# EAGLE design uTTA_V1_Power (EAGLE 6.3)
VERSION: V1.0

## Sheet 1 of 3
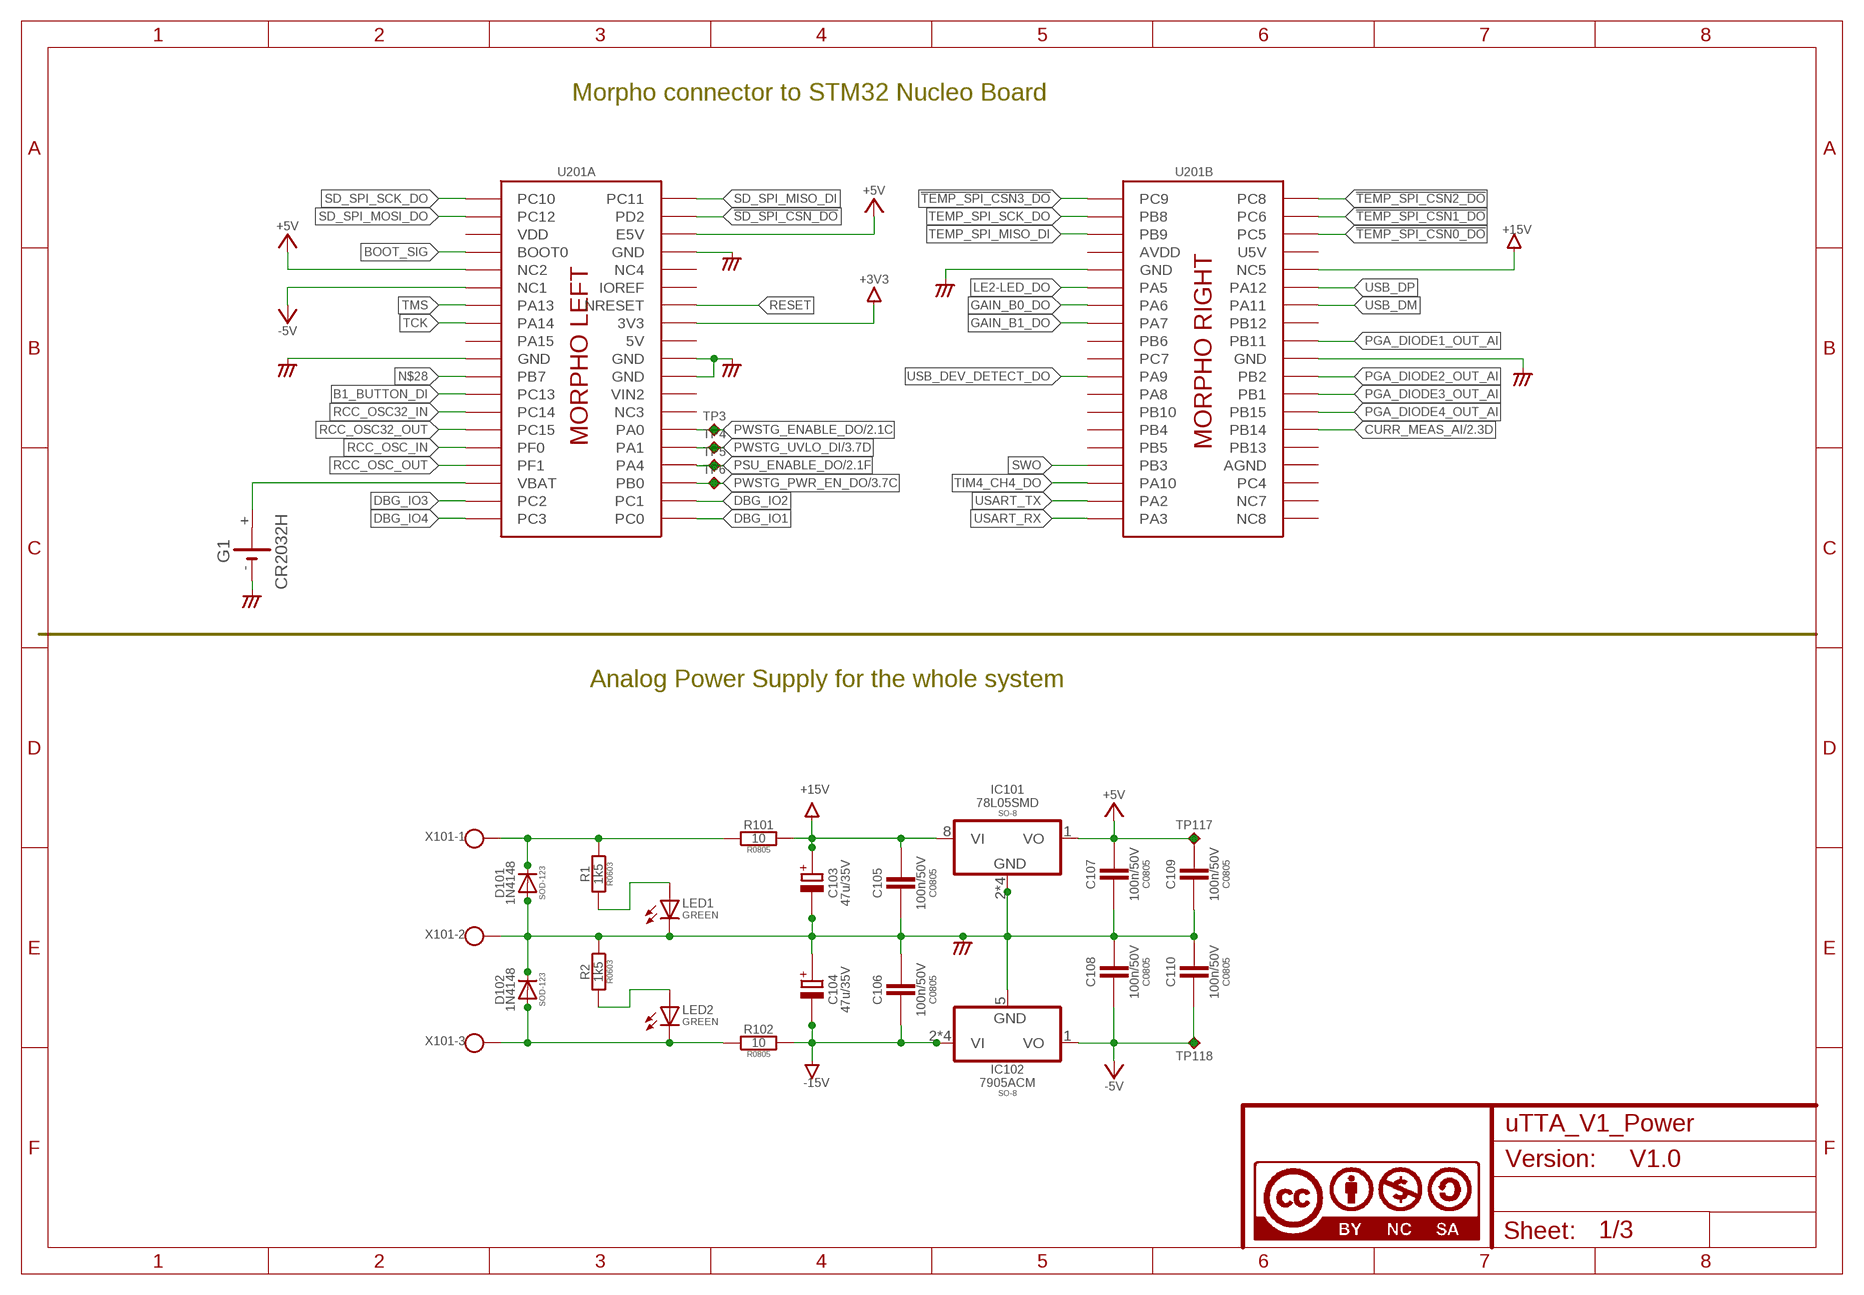
[diagram p0: schematic, sheet 1]

### Parts
C103  47u/35V  CPOL-EUD  [PANASONIC_D]
C104  47u/35V  CPOL-EUD  [PANASONIC_D]
C105  100n/50V  C-EUC0805  [C0805]
C106  100n/50V  C-EUC0805  [C0805]
C107  100n/50V  C-EUC0805  [C0805]
C108  100n/50V  C-EUC0805  [C0805]
C109  100n/50V  C-EUC0805  [C0805]
C110  100n/50V  C-EUC0805  [C0805]
D101  1N4148  DIODE-SOD123  [SOD123]
D102  1N4148  DIODE-SOD123  [SOD123]
G1  CR2032H  [CR2032H]
IC101  78L05SMD  78L08SMD  [SO08]
IC102  7905ACM  [SO08]
LED1  GREEN  LEDSML0805  [SML0805]
LED2  GREEN  LEDSML0805  [SML0805]
R1  1k5  R-EU_R0603  [R0603]
R2  1k5  R-EU_R0603  [R0603]
R101  10  R-EU_R0805  [R0805]
R102  10  R-EU_R0805  [R0805]
TP3  TPC90H30  [C90H30]
TP4  TPC90H30  [C90H30]
TP5  TPC90H30  [C90H30]
TP6  TPC90H30  [C90H30]
TP117  TPC90H30  [C90H30]
TP118  TPC90H30  [C90H30]
U201  NUCLEO_F103_BOT  [NUCLEO_BRD64_LOWER]
X101  AST_03_3,5MM  AST_03_3,5MM_45°  [AST_453_3,5]

### Nets
!SD_SPI_CSN_DO: U201.L_PD2(A:PD2)
!TEMP_SPI_CSN0_DO: U201.R_PC5(B:PC5)
!TEMP_SPI_CSN1_DO: U201.R_PC6(B:PC6)
!TEMP_SPI_CSN2_DO: U201.R_PC8(B:PC8)
!TEMP_SPI_CSN3_DO: U201.R_PC9(B:PC9)
+3V3: U201.L_3V3(A:3V3)
+5V: C107.1 C109.1 IC101.1(VO) TP117.P$1(TP) U201.L_E5V(A:E5V) U201.L_NC2(A:NC2) ; also sheet 2,3
+15V: C103.+ C105.1 IC101.8(VI) R101.2 U201.R_NC5(B:NC5)
-5V: C108.2 C110.2 IC102.1(VO) TP118.P$1(TP) U201.L_NC1(A:NC1) ; also sheet 2
-15V: C104.- C106.2 IC102.2(VI) IC102.3(VI) IC102.6(VI) IC102.7(VI) R102.2
AGND: C103.- C104.+ C105.2 C106.1 C107.2 C108.1 C109.2 C110.1 D101.A D102.C G1.- IC101.2(GND) IC101.3(GND) IC101.6(GND) IC101.7(GND) IC102.5(GND) LED1.C R2.1 U201.L_GND3(A:GND) U201.L_GND4(A:GND) U201.L_GND5(A:GND) U201.L_GND(A:GND) U201.R_GND7(B:GND) U201.R_GND8(B:GND) X101.2_1 X101.2_2 ; supply symbol labelled AGND_ ; also sheet 2,3
B1_BUTTON_DI: U201.L_PC13(A:PC13)
BOOT_SIG: U201.L_BOOT0(A:BOOT0)
CURR_MEAS_AI [Analog_Sig]: U201.R_PB14(B:PB14) ; also sheet 2
DBG_IO1: U201.L_PC0(A:PC0)
DBG_IO2: U201.L_PC1(A:PC1)
DBG_IO3: U201.L_PC2(A:PC2)
DBG_IO4: U201.L_PC3(A:PC3)
GAIN_B0_DO: U201.R_PA6(B:PA6)
GAIN_B1_DO: U201.R_PA7(B:PA7)
IN+: D101.C R1.1 R101.1 X101.1_1 X101.1_2
IN-: D102.A LED2.C R102.1 X101.3_1 X101.3_2
LE2-LED_DO: U201.R_PA5(B:PA5)
N$12: G1.+ U201.L_VBAT(A:VBAT)
N$28: U201.L_PB7(A:PB7)
N$54: LED1.A R1.2
N$58: LED2.A R2.2
PGA_DIODE1_OUT_AI: U201.R_PB11(B:PB11)
PGA_DIODE2_OUT_AI: U201.R_PB2(B:PB2)
PGA_DIODE3_OUT_AI: U201.R_PB1(B:PB1)
PGA_DIODE4_OUT_AI: U201.R_PB15(B:PB15)
PSU_ENABLE_DO: TP5.P$1(TP) U201.L_PA4(A:PA4) ; also sheet 2
PWSTG_ENABLE_DO: TP3.P$1(TP) U201.L_PA0(A:PA0) ; also sheet 2
PWSTG_PWR_EN_DO: TP6.P$1(TP) U201.L_PB0(A:PB0) ; also sheet 3
PWSTG_UVLO_DI: TP4.P$1(TP) U201.L_PA1(A:PA1) ; also sheet 3
RCC_OSC32_IN: U201.L_PC14(A:PC14)
RCC_OSC32_OUT: U201.L_PC15(A:PC15)
RCC_OSC_IN: U201.L_PF0(A:PF0)
RCC_OSC_OUT: U201.L_PF1(A:PF1)
RESET: U201.L_RESET(A:NRESET)
SD_SPI_MISO_DI: U201.L_PC11(A:PC11)
SD_SPI_MOSI_DO: U201.L_PC12(A:PC12)
SD_SPI_SCK_DO: U201.L_PC10(A:PC10)
SWO: U201.R_PB3(B:PB3)
TCK: U201.L_PA14(A:PA14)
TEMP_SPI_MISO_DI: U201.R_PB9(B:PB9)
TEMP_SPI_SCK_DO: U201.R_PB8(B:PB8)
TIM4_CH4_DO: U201.R_PA10(B:PA10)
TMS: U201.L_PA13(A:PA13)
USART_RX: U201.R_PA3(B:PA3)
USART_TX: U201.R_PA2(B:PA2)
USB_DEV_DETECT_DO: U201.R_PA9(B:PA9)
USB_DM: U201.R_PA11(B:PA11)
USB_DP: U201.R_PA12(B:PA12)
Unconnected: G1.+@1(+) U201.L_IOREF(A:IOREF) U201.L_NC3(A:NC3) U201.L_NC4(A:NC4) U201.L_PA15(A:PA15) U201.R_NC7(B:NC7) U201.R_NC8(B:NC8) U201.R_PA8(B:PA8) U201.R_PB4(B:PB4) U201.R_PB5(B:PB5) U201.R_PB6(B:PB6) U201.R_PB10(B:PB10) U201.R_PB12(B:PB12) U201.R_PB13(B:PB13) U201.R_PC4(B:PC4) U201.R_PC7(B:PC7)

### Notes on the sheet
- Morpho connector to STM32 Nucleo Board
- Analog Power Supply for the whole system

## Sheet 2 of 3
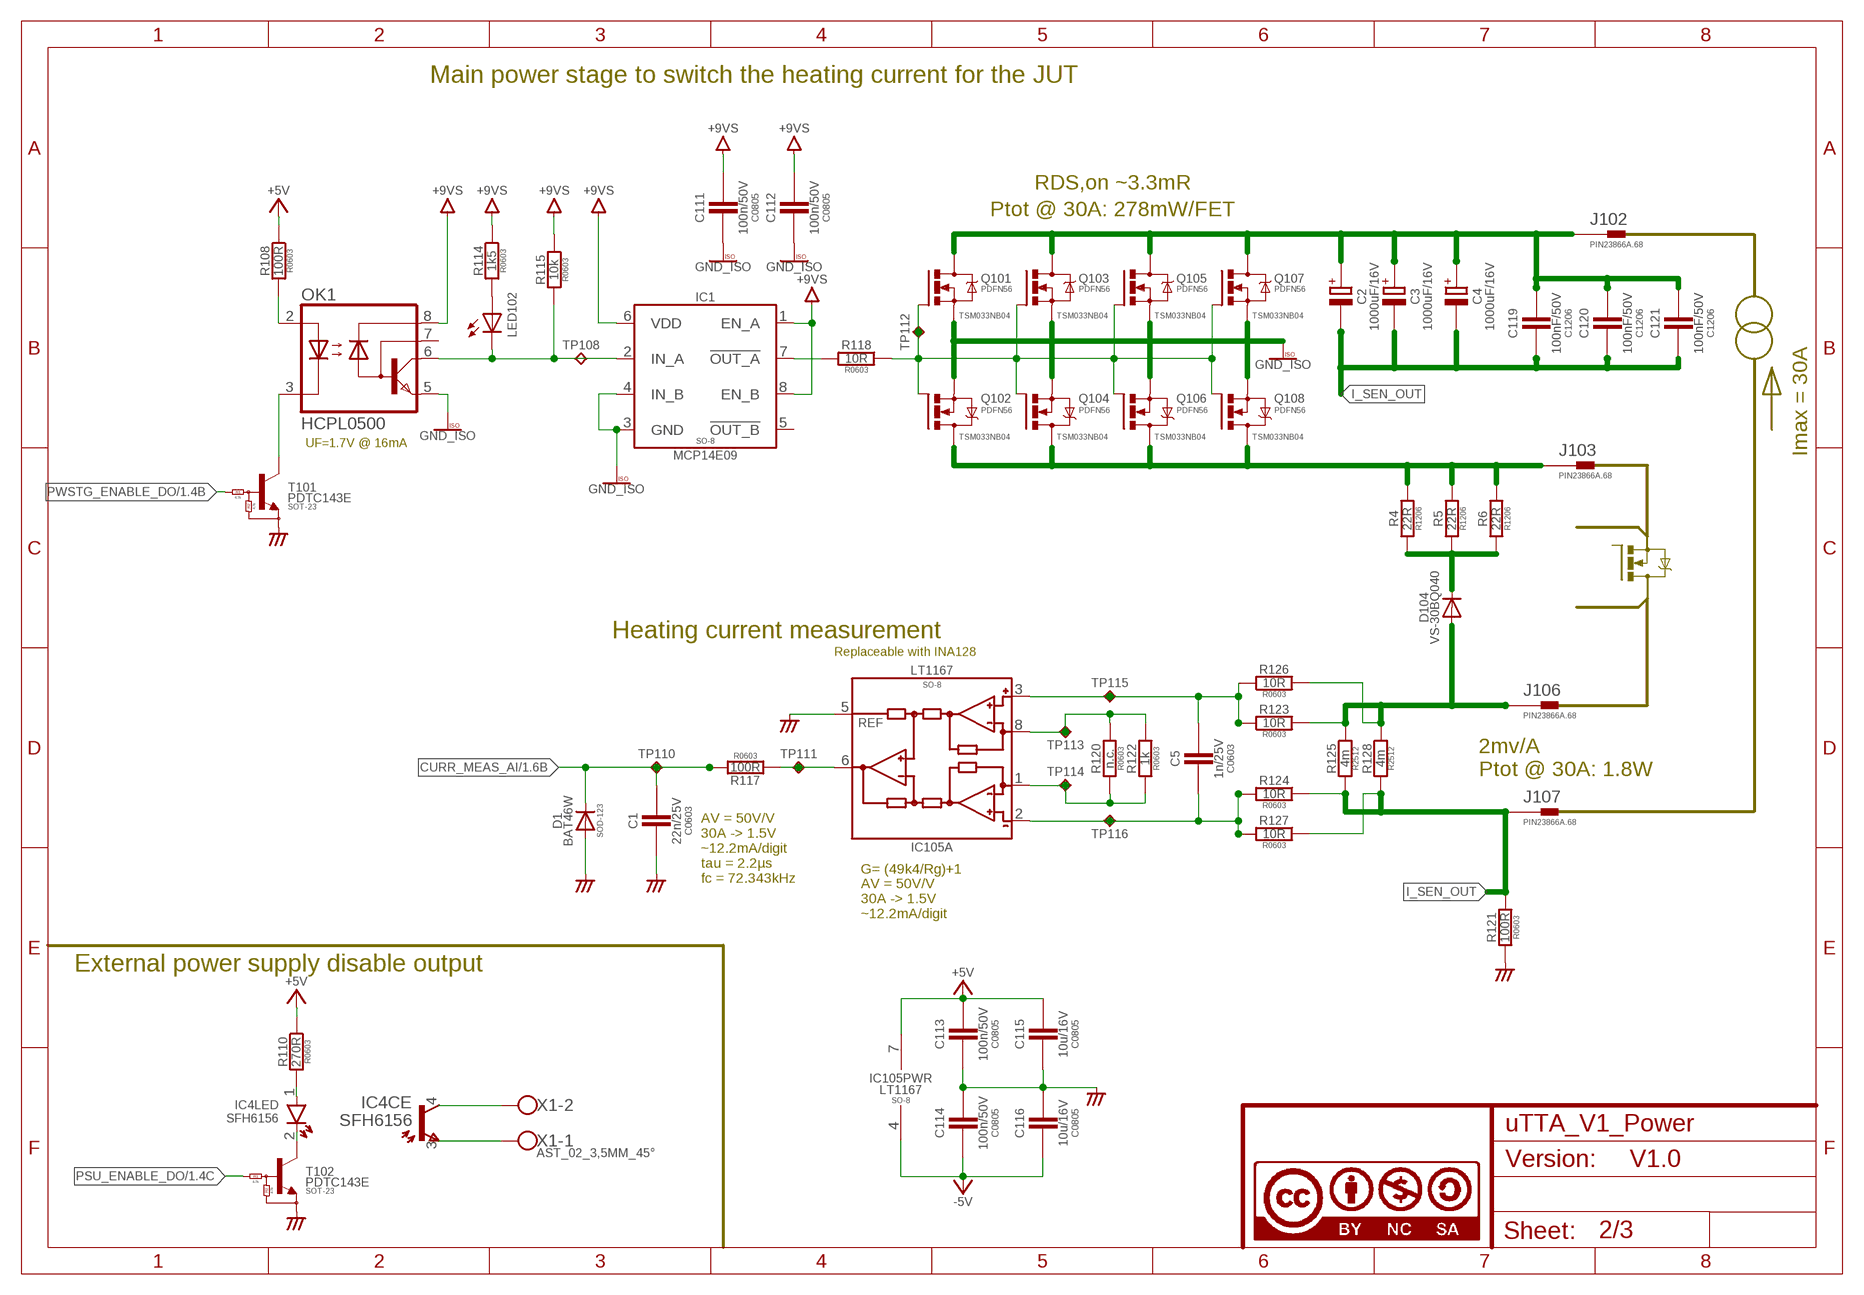
[diagram p1: schematic, sheet 2]

### Parts
C1  22n/25V  C-EUC0603  [C0603]
C2  1000uF/16V  CPOL-EUE5-10.5  [E5-10,5]
C3  1000uF/16V  CPOL-EUE5-10.5  [E5-10,5]
C4  1000uF/16V  CPOL-EUE5-10.5  [E5-10,5]
C5  1n/25V  C-EUC0603  [C0603]
C111  100n/50V  C-EUC0805  [C0805]
C112  100n/50V  C-EUC0805  [C0805]
C113  100n/50V  C-EUC0805  [C0805]
C114  100n/50V  C-EUC0805  [C0805]
C115  10u/16V  C-EUC0805  [C0805]
C116  10u/16V  C-EUC0805  [C0805]
C119  100nF/50V  C-EUC1206  [C1206]
C120  100nF/50V  C-EUC1206  [C1206]
C121  100nF/50V  C-EUC1206  [C1206]
D1  BAT46W  DIODE-SOD123  [SOD123]
D104  VS-30BQ040  DIODE-SMC  [SMC]
IC1  MCP14E09  [SO-08]
IC4  SFH6156  [SFH]
IC105  LT1167  [SO08]
J102  PIN23866A.68  [VOGT_3866A.68]
J103  PIN23866A.68  [VOGT_3866A.68]
J106  PIN23866A.68  [VOGT_3866A.68]
J107  PIN23866A.68  [VOGT_3866A.68]
LED102  LEDSML0805  [SML0805]
OK1  HCPL0500  [SOIC08]
Q101  TSM033NB04  TSM033NB04CR  [PDFN56]
Q102  TSM033NB04  TSM033NB04CR  [PDFN56]
Q103  TSM033NB04  TSM033NB04CR  [PDFN56]
Q104  TSM033NB04  TSM033NB04CR  [PDFN56]
Q105  TSM033NB04  TSM033NB04CR  [PDFN56]
Q106  TSM033NB04  TSM033NB04CR  [PDFN56]
Q107  TSM033NB04  TSM033NB04CR  [PDFN56]
Q108  TSM033NB04  TSM033NB04CR  [PDFN56]
R4  22R  R-EU_R1206  [R1206]
R5  22R  R-EU_R1206  [R1206]
R6  22R  R-EU_R1206  [R1206]
R108  100R  R-EU_R0603  [R0603]
R110  270R  R-EU_R0603  [R0603]
R114  1k5  R-EU_R0603  [R0603]
R115  10k  R-EU_R0603  [R0603]
R117  100R  R-EU_R0603  [R0603]
R118  10R  R-EU_R0603  [R0603]
R120  n.c.  R-EU_R0603  [R0603]
R121  100R  R-EU_R0603  [R0603]
R122  1k  R-EU_R0603  [R0603]
R123  10R  R-EU_R0603  [R0603]
R124  10R  R-EU_R0603  [R0603]
R125  4m  WSL2512  [R2512]
R126  10R  R-EU_R0603  [R0603]
R127  10R  R-EU_R0603  [R0603]
R128  4m  WSL2512  [R2512]
T101  PDTC143E  [SOT23]
T102  PDTC143E  [SOT23]
TP108  TPC90H30  [C90H30]
TP110  TPC90H30  [C90H30]
TP111  TPC90H30  [C90H30]
TP112  TPC90H30  [C90H30]
TP113  TP  [C90]
TP114  TP  [C90]
TP115  TPC90H30  [C90H30]
TP116  TPC90H30  [C90H30]
X1  AST_02_3,5MM_45°  [AST_452_3,5]

### Nets
9V_SWITCHED: C111.1 C112.1 IC1.1(EN_A) IC1.6(VDD) IC1.8(EN_B) OK1.8(VCC) R114.1 R115.1 ; supply symbol labelled +9VS ; also sheet 3
+5V: C113.1 C115.1 IC105.7(PWR:V+) R108.1 R110.1 ; also sheet 1,3
-5V: C114.2 C116.2 IC105.4(PWR:V-) ; also sheet 1
AGND: C1.2 C113.2 C114.1 C115.2 C116.1 D1.A IC105.5(A:REF) R121.1 T101.2(E) T102.2(E) ; supply symbol labelled AGND_ ; also sheet 1,3
CURR_AMP_GAIN_N [Analog_Sig]: IC105.1(A:RG) R120.1 R122.1 TP114.P$1(TP)
CURR_AMP_GAIN_P [Analog_Sig]: IC105.8(A:RG) R120.2 R122.2 TP113.P$1(TP)
CURR_AMP_OUT [Analog_Sig]: IC105.6(A:OUT) R117.2 TP111.P$1(TP)
CURR_MEAS_AI [Analog_Sig]: C1.1 D1.C R117.1 TP110.P$1(TP) ; also sheet 1
GND_ISO: C111.2 C112.2 IC1.3(GND) IC1.4(IN_B) OK1.5(GND) Q101.P$1(S) Q101.P$2(S) Q101.P$3(S) Q102.P$1(S) Q102.P$2(S) Q102.P$3(S) Q103.P$1(S) Q103.P$2(S) Q103.P$3(S) Q104.P$1(S) Q104.P$2(S) Q104.P$3(S) Q105.P$1(S) Q105.P$2(S) Q105.P$3(S) Q106.P$1(S) Q106.P$2(S) Q106.P$3(S) Q107.P$1(S) Q107.P$2(S) Q107.P$3(S) Q108.P$1(S) Q108.P$2(S) Q108.P$3(S) ; also sheet 3
I_SEN_IN: D104.A J106.A1 J106.A2 R123.2 R125.2(B) R126.2 R128.2(B)
I_SEN_OUT: C2.- C3.- C4.- C119.2 C120.2 C121.2 J107.A1 J107.A2 R121.2 R124.1 R125.1(A) R127.1 R128.1(A)
I_SENSE_N [Analog_Diff]: C5.2 IC105.2(A:-IN) R124.2 R127.2 TP116.P$1(TP)
I_SENSE_P [Analog_Diff]: C5.1 IC105.3(A:+IN) R123.1 R126.1 TP115.P$1(TP)
N$1: C2.+ C3.+ C4.+ C119.1 C120.1 C121.1 J102.A1 J102.A2 Q101.P$5(D) Q101.P$6(D) Q101.P$7(D) Q101.P$8(D) Q101.P$9(D) Q103.P$5(D) Q103.P$6(D) Q103.P$7(D) Q103.P$8(D) Q103.P$9(D) Q105.P$5(D) Q105.P$6(D) Q105.P$7(D) Q105.P$8(D) Q105.P$9(D) Q107.P$5(D) Q107.P$6(D) Q107.P$7(D) Q107.P$8(D) Q107.P$9(D)
N$2: IC1.7(!OUT_A) R118.2
N$3: Q101.P$4(G) Q102.P$4(G) Q103.P$4(G) Q104.P$4(G) Q105.P$4(G) Q106.P$4(G) Q107.P$4(G) Q108.P$4(G) R118.1 TP112.P$1(TP)
N$4: IC4.1(LED:A) R110.2
N$5: IC1.2(IN_A) LED102.C OK1.6(VO) R115.2 TP108.P$1(TP)
N$8: IC4.2(LED:K) T102.3(C)
N$16: LED102.A R114.2
N$18: OK1.3(C) T101.3(C)
N$23: D104.C R4.1 R5.1 R6.1
N$46: OK1.2(A) R108.2
N$47: J103.A1 J103.A2 Q102.P$5(D) Q102.P$6(D) Q102.P$7(D) Q102.P$8(D) Q102.P$9(D) Q104.P$5(D) Q104.P$6(D) Q104.P$7(D) Q104.P$8(D) Q104.P$9(D) Q106.P$5(D) Q106.P$6(D) Q106.P$7(D) Q106.P$8(D) Q106.P$9(D) Q108.P$5(D) Q108.P$6(D) Q108.P$7(D) Q108.P$8(D) Q108.P$9(D) R4.2 R5.2 R6.2
OK_PSU_C [Digital_Sig]: IC4.4(CE:C) X1.2_1 X1.2_2
OK_PSU_E [Digital_Sig]: IC4.3(CE:E) X1.1_1 X1.1_2
PSU_ENABLE_DO: T102.1(B) ; also sheet 1
PWSTG_ENABLE_DO: T101.1(B) ; also sheet 1
Unconnected: IC1.5(!OUT_B) OK1.7(VB)

### Notes on the sheet
- Main power stage to switch the heating current for the JUT
- RDS,on ~3.3mR
- Ptot @ 30A: 278mW/FET
- UF=1.7V @ 16mA
- Imax = 30A
- Heating current measurement
- Replaceable with INA128
- 2mv/A
  Ptot @ 30A: 1.8W
- G= (49k4/Rg)+1
- AV = 50V/V
  30A -> 1.5V
  ~12.2mA/digit
  tau = 2.2µs
  fc = 72.343kHz
- AV = 50V/V
  30A -> 1.5V
  ~12.2mA/digit
- External power supply disable output

## Sheet 3 of 3
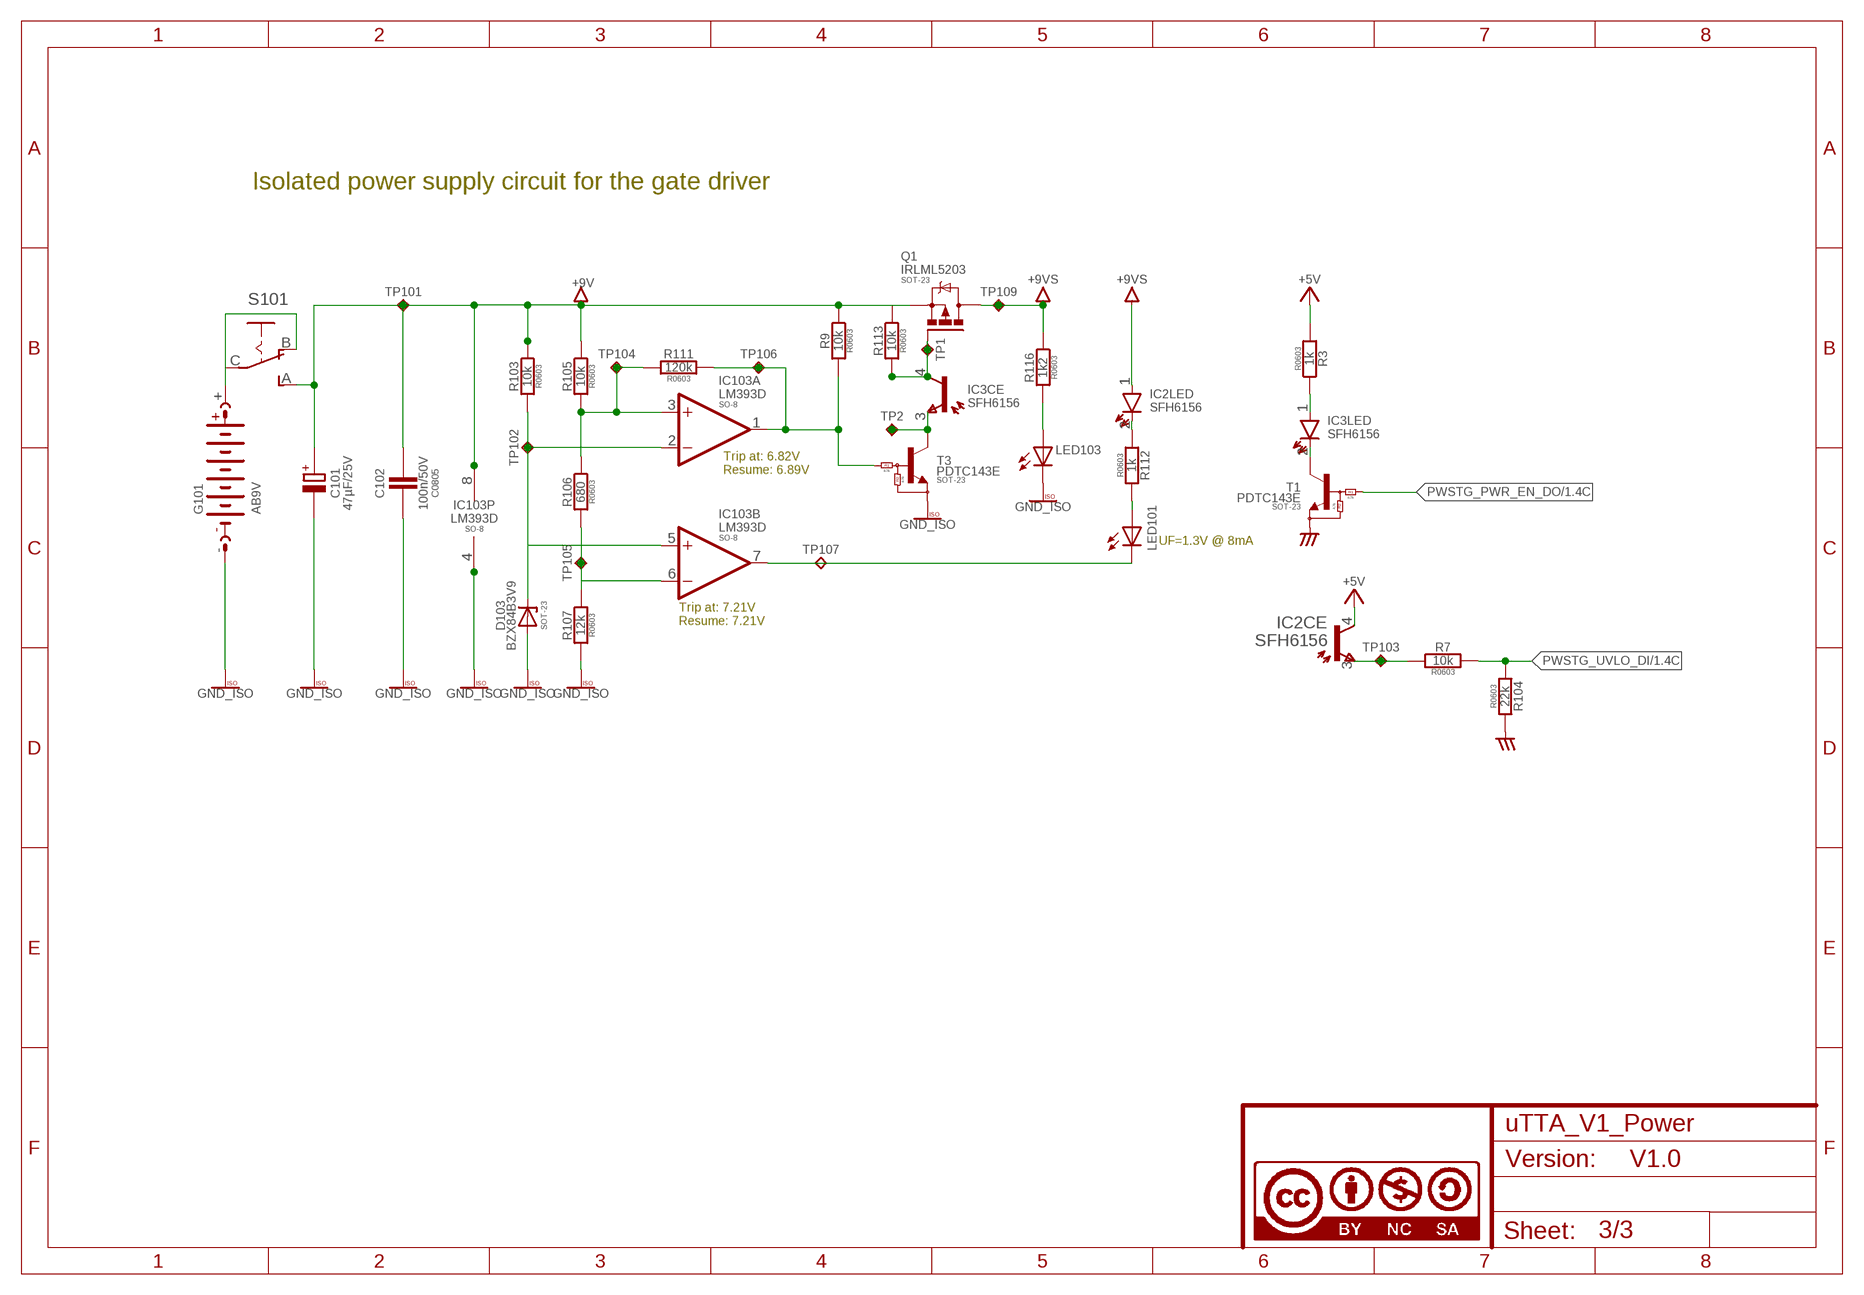
[diagram p2: schematic, sheet 3]

### Parts
C101  47µF/25V  CPOL-EUD  [PANASONIC_D]
C102  100n/50V  C-EUC0805  [C0805]
D103  BZX84B3V9  BZX84B  [SOT23]
G101  AB9V  [AB9V]
IC2  SFH6156  [SFH]
IC3  SFH6156  [SFH]
IC103  LM393D  [SO08]
LED101  LEDSML0805  [SML0805]
LED103  LEDSML0805  [SML0805]
Q1  IRLML5203  [MICRO3]
R3  1k  R-EU_R0603  [R0603]
R7  10k  R-EU_R0603  [R0603]
R9  10k  R-EU_R0603  [R0603]
R103  10k  R-EU_R0603  [R0603]
R104  22k  R-EU_R0603  [R0603]
R105  10k  R-EU_R0603  [R0603]
R106  680  R-EU_R0603  [R0603]
R107  12k  R-EU_R0603  [R0603]
R111  120k  R-EU_R0603  [R0603]
R112  1k  R-EU_R0603  [R0603]
R113  10k  R-EU_R0603  [R0603]
R116  1k2  R-EU_R0603  [R0603]
S101  SS_ESP101  [SS_ESP101]
T1  PDTC143E  [SOT23]
T3  PDTC143E  [SOT23]
TP1  TPC90H30  [C90H30]
TP2  TPC90H30  [C90H30]
TP101  TPC90H30  [C90H30]
TP102  TPC90H30  [C90H30]
TP103  TPC90H30  [C90H30]
TP104  TPC90H30  [C90H30]
TP105  TPC90H30  [C90H30]
TP106  TPC90H30  [C90H30]
TP107  TPC90H30  [C90H30]
TP109  TPC90H30  [C90H30]

### Nets
9V_SWITCHED: IC2.1(LED:A) Q1.3(D) R116.1 TP109.P$1(TP) ; supply symbol labelled +9VS ; also sheet 2
+5V: IC2.4(CE:C) R3.2 ; also sheet 1,2
+9V: C101.+ C102.1 IC103.8(P:V+) Q1.2(S) R9.1 R103.1 R105.1 R113.1 S101.A(S) TP101.P$1(TP)
AGND: R104.2 T1.2(E) ; supply symbol labelled AGND_ ; also sheet 1,2
GND_ISO: C101.- C102.2 D103.1(A) G101.- IC103.4(P:V-) LED103.C R107.2 T3.2(E) ; also sheet 2
N$7: IC103.7(B:OUT) LED101.C TP107.P$1(TP)
N$13: G101.+ S101.B(O) S101.C(P)
N$14: LED103.A R116.2
N$15: IC3.4(CE:C) Q1.1(G) R113.2 TP1.P$1(TP)
N$21: IC3.2(LED:K) T1.3(C)
N$22: IC3.1(LED:A) R3.1
N$24: IC2.3(CE:E) R7.1 TP103.P$1(TP)
N$26: IC3.3(CE:E) T3.3(C) TP2.P$1(TP)
N$32: D103.3(C) IC103.2(A:-IN) IC103.5(B:+IN) R103.2 TP102.P$1(TP)
N$33: IC103.6(B:-IN) R106.2 R107.1 TP105.P$1(TP)
N$41: IC103.3(A:+IN) R105.2 R106.1 R111.2 TP104.P$1(TP)
N$42: IC2.2(LED:K) R112.2
N$43: IC103.1(A:OUT) R9.2 R111.1 T3.1(B) TP106.P$1(TP)
N$53: LED101.A R112.1
PWSTG_PWR_EN_DO: T1.1(B) ; also sheet 1
PWSTG_UVLO_DI: R7.2 R104.1 ; also sheet 1

### Notes on the sheet
- Isolated power supply circuit for the gate driver
- Trip at: 6.82V
  Resume: 6.89V
- UF=1.3V @ 8mA
- Trip at: 7.21V
  Resume: 7.21V

## Power pins joined to a net without a drawn wire
5V: U201.L_5V(A:5V)
AGND: U201.R_AGND(B:AGND)
AVDD: U201.R_AVDD(B:AVDD)
U5V: U201.R_U5V(B:U5V)
VDD: U201.L_VDD(A:VDD)
VIN2: U201.L_VIN(A:VIN2)

## Library data of the parts
C1 C5 = A_Kondensatoren:C-EU: CAPACITOR, European symbol; PACKAGE: C0603
C2-C4 C101 C103 C104 = A_Kondensatoren:CPOL-EU: POLARIZED CAPACITOR, European symbol
C102 C105-C116 = A_Kondensatoren:C-EU: CAPACITOR, European symbol; PACKAGE: C0805
C119-C121 = A_Kondensatoren:C-EU: CAPACITOR, European symbol; PACKAGE: C1206
D1 D101 D102 = A_Dioden:DIODE-: DIODE; PACKAGE: SOD-123
D103 = A_Dioden:BZX84B; PACKAGE: SOT-23
D104 = A_Dioden:DIODE-: DIODE; PACKAGE: SMB
G1 = battery:CR2032H: LI BATTERY Varta
G101 = battery:AB9V: 9-V BATTERY CLIP
IC1 = A_Microchip:MCP14E09; PACKAGE: SO-8
IC2-IC4 = A_Optokoppler:SFH6156: 5.3 kV TRIOS High Reliability Optocoupler; MF: VISHAY/TELEFUNKEN; MPN: SFH6156-4T; OC_FARNELL: 1612479; OC_NEWARK: 21H7733
IC101 = A_Linear_IC:78L*SMD: Positive VOLTAGE REGULATOR; PACKAGE: SO-8
IC102 = A_Linear_IC:79*: Negative VOLTAGE REGULATOR; PACKAGE: SO-8
IC103 = A_Linear_IC:LM393: COMPARATOR; PACKAGE: SO-8
IC105 = A_Linear_Technology:LT1167; PACKAGE: SO-8
J102 J103 J106 J107 = A_Steckverbinder:PIN2: Flachstecker Typ Tyco/Electronics/AMP TAB, FASTON Printed Circuit Board Tabs Source: http://www.buerklin.com, http://catalog.tycoelectronics.com
LED1 LED2 LED101-LED103 = led:LED: LED OSRAM: - CHIPLED LG R971, LG N971, LY N971, LG Q971, LY Q971, LO R971, LY R971 LH N974, LH R974 LS Q976, LO Q976, LY Q976 LO Q996 - Hyper CHIPLED LW Q18S LB Q993, LB Q99A, LB R99A - SideLED LS A670, LO A670, LY A670, LG A670, LP A670 LB A673, LV A673, LT A673, LW A673 LH A674 LY A675 LS A676, LA A676, LO A676, LY A676, LW A676 LS A679, LY A679, LG A679 - Hyper Micro SIDELED® LS Y876, LA Y876, LO Y876, LY Y876 LT Y87S - SmartLED LW L88C, LW L88S LB L89C, LB L89S, LG L890 LS L89K, LO L89K, LY L89K LS L896, LA L896, LO L896, LY L896 - TOPLED LS T670, LO T670, LY T670, LG T670, LP T670 LSG T670, LSP T670, LSY T670, LOP T670, LYG T670 LG T671, LOG T671, LSG T671 LB T673, LV T673, LT T673, LW T673 LH T674 LS T676, LA T676, LO T676, LY T676, LB T676, LH T676, LSB T676, LW T676 LB T67C, LV T67C, LT T67C, LS T67K, LO T67K, LY T67K, LW E67C LS E67B, LA E67B, LO E67B, LY E67B, LB E67C, LV E67C, LT E67C LW T67C LS T679, LY T679, LG T679 LS T770, LO T770, LY T770, LG T770, LP T770 LB T773, LV T773, LT T773, LW T773 LH T774 LS E675, LA E675, LY E675, LS T675 LS T776, LA T776, LO T776, LY T776, LB T776 LHGB T686 LT T68C, LB T68C - Hyper Mini TOPLED® LB M676 - Mini TOPLED Santana® LG M470 LS M47K, LO M47K, LY M47K Source: http://www.osram.convergy.de LUXEON: - LUMILED® LXK2-PW12-R00, LXK2-PW12-S00, LXK2-PW14-U00, LXK2-PW14-V00 LXK2-PM12-R00, LXK2-PM12-S00, LXK2-PM14-U00 LXK2-PE12-Q00, LXK2-PE12-R00, LXK2-PE12-S00, LXK2-PE14-T00, LXK2-PE14-U00 LXK2-PB12-K00, LXK2-PB12-L00, LXK2-PB12-M00, LXK2-PB14-N00, LXK2-PB14-P00, LXK2-PB14-Q00 LXK2-PR12-L00, LXK2-PR12-M00, LXK2-PR14-Q00, LXK2-PR14-R00 LXK2-PD12-Q00, LXK2-PD12-R00, LXK2-PD12-S00 LXK2-PH12-R00, LXK2-PH12-S00 LXK2-PL12-P00, LXK2-PL12-Q00, LXK2-PL12-R00 Source: www.luxeon.com KINGBRIGHT: KA-3528ASYC Source: www.kingbright.com
OK1 = optocoupler:HCPL0500: HEWLETT PACKARD OPTO COUPLER
Q1 = A_Transistoren:IRLML5203: HEXFET P-Channel Power MOSFET; PACKAGE: SOT-23
Q101-Q108 = A_Transistoren:TSM033NB04CR: N-Ch MOSFET; PACKAGE: PDFN56
R1-R3 R7 R9 R103-R108 R110-R118 R120-R124 R126 R127 = A_Resistor:R-EU_: RESISTOR, European symbol; PACKAGE: R0603
R4-R6 = A_Resistor:R-EU_: RESISTOR, European symbol; PACKAGE: R1206
R101 R102 = A_Resistor:R-EU_: RESISTOR, European symbol; PACKAGE: R0805
R125 R128 = A_Shunts:WSL2512; PACKAGE: R2512
S101 = A_Schalter:SS_ESP101
T1 T3 T101 T102 = A_Transistoren:PDTC*: <N>NPN Resistor equipped transistors Part R1 R2 PDTA114E 10k 10k PDTA114T 10k open PDTA114Y 10k 47k PDTA115E 100k 100k PDTA115T 100k open PDTA123E 2.2k 2.2k PDTA123J 2.2k 47k PDTA123T 2.2k open PDTA123Y 2.2k 10k PDTA124E 4.7k 4.7k PDTA124T 22k open PDTA124X 22k 47k PDTA143E 4.7k 4.7k PDTA143T 4.7k open PDTA143X 4.7k 10k PDTA143Z 4.7k 47k PDTA144E 47k 47k PDTA144T 10k open PDTA144V 47k 10k PDTA144W 47k 22k; I_OUT: 100mA; PACKAGE: SOT-23; R1: 4.7k; R2: 4.7k
TP1-TP6 TP101-TP118 = A_Testpoint:TP
U201 = A_Stm32nucleo:NUCLEO_F103_BOT
X1 = A_Steckverbinder:AST_02
X101 = A_Steckverbinder:AST_03

## Net classes
0 default: width 0.254 mm, drill 0.3 mm, clearance 0.2 mm
1 Analog_Sig: width 0.305 mm, drill 0.3 mm, clearance 0.4 mm to class 0, clearance 0.3 mm
2 Digital_Sig: width 0.305 mm, drill 0.3 mm, clearance 0.25 mm to class 0, clearance 0.4 mm to class 1, clearance 0.3 mm
3 Analog_Diff: width 0.406 mm, drill 0.3 mm, clearance 0.5 mm to class 0, clearance 0.5 mm to class 1, clearance 0.5 mm to class 2, clearance 0.4 mm
9 GND: width 0.3 mm, drill 0.3 mm, clearance 0.2 mm to class 0, clearance 0.2 mm to class 1, clearance 0.2 mm to class 2, clearance 0.3 mm to class 3, clearance 0.2 mm to class 4, clearance 0.25 mm to class 5, clearance 0.25 mm to class 6, clearance 0.4 mm to class 7, clearance 0.4 mm to class 8, clearance 0.2 mm

## Board
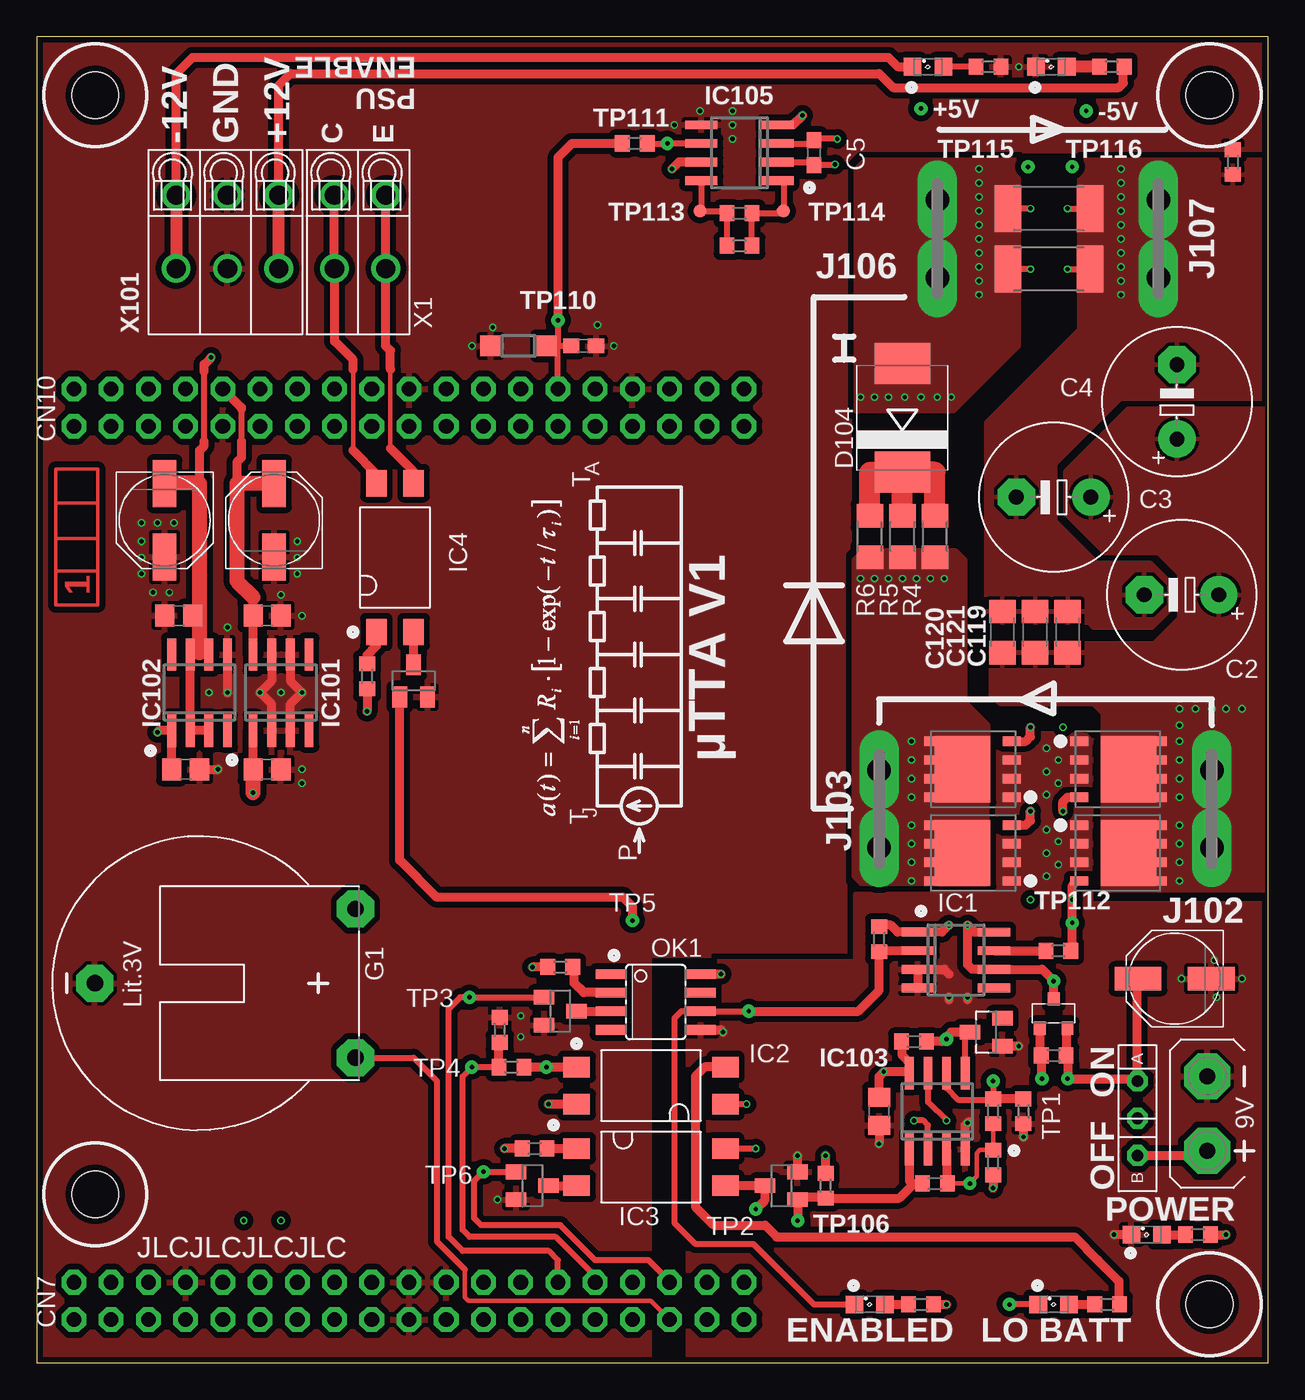
[diagram p3: board, top side]
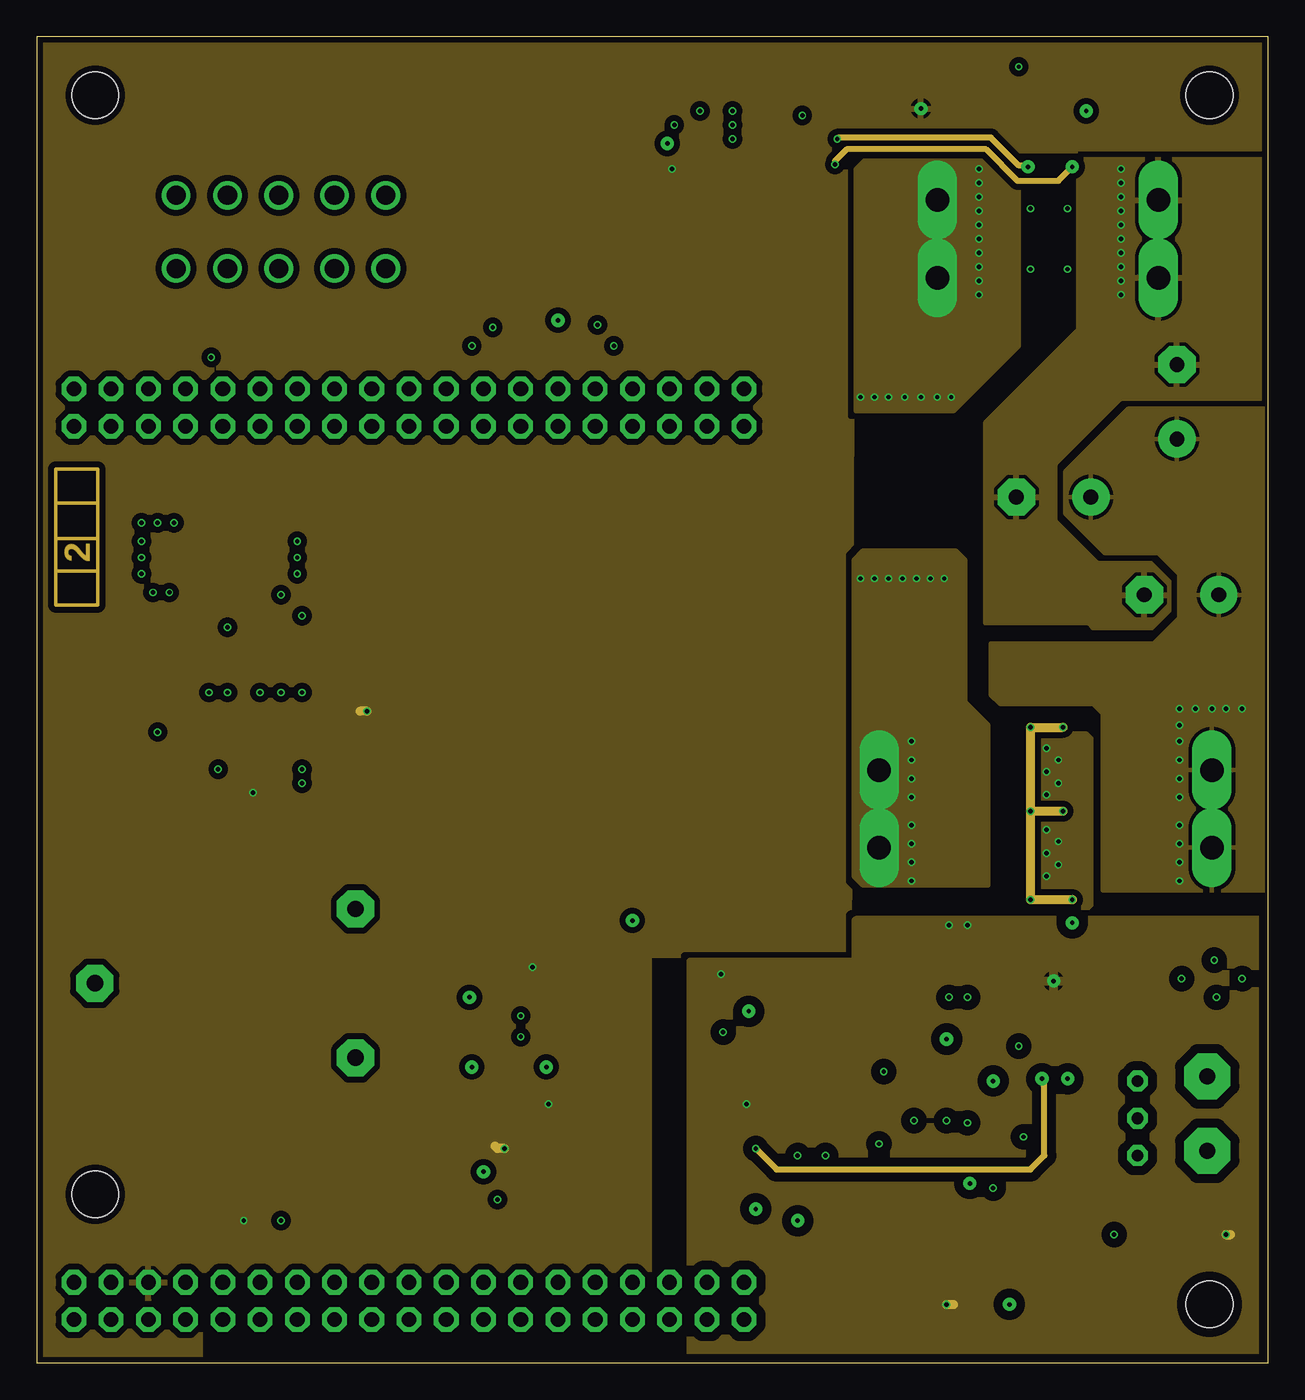
[diagram p4: board, inner layer Route2]
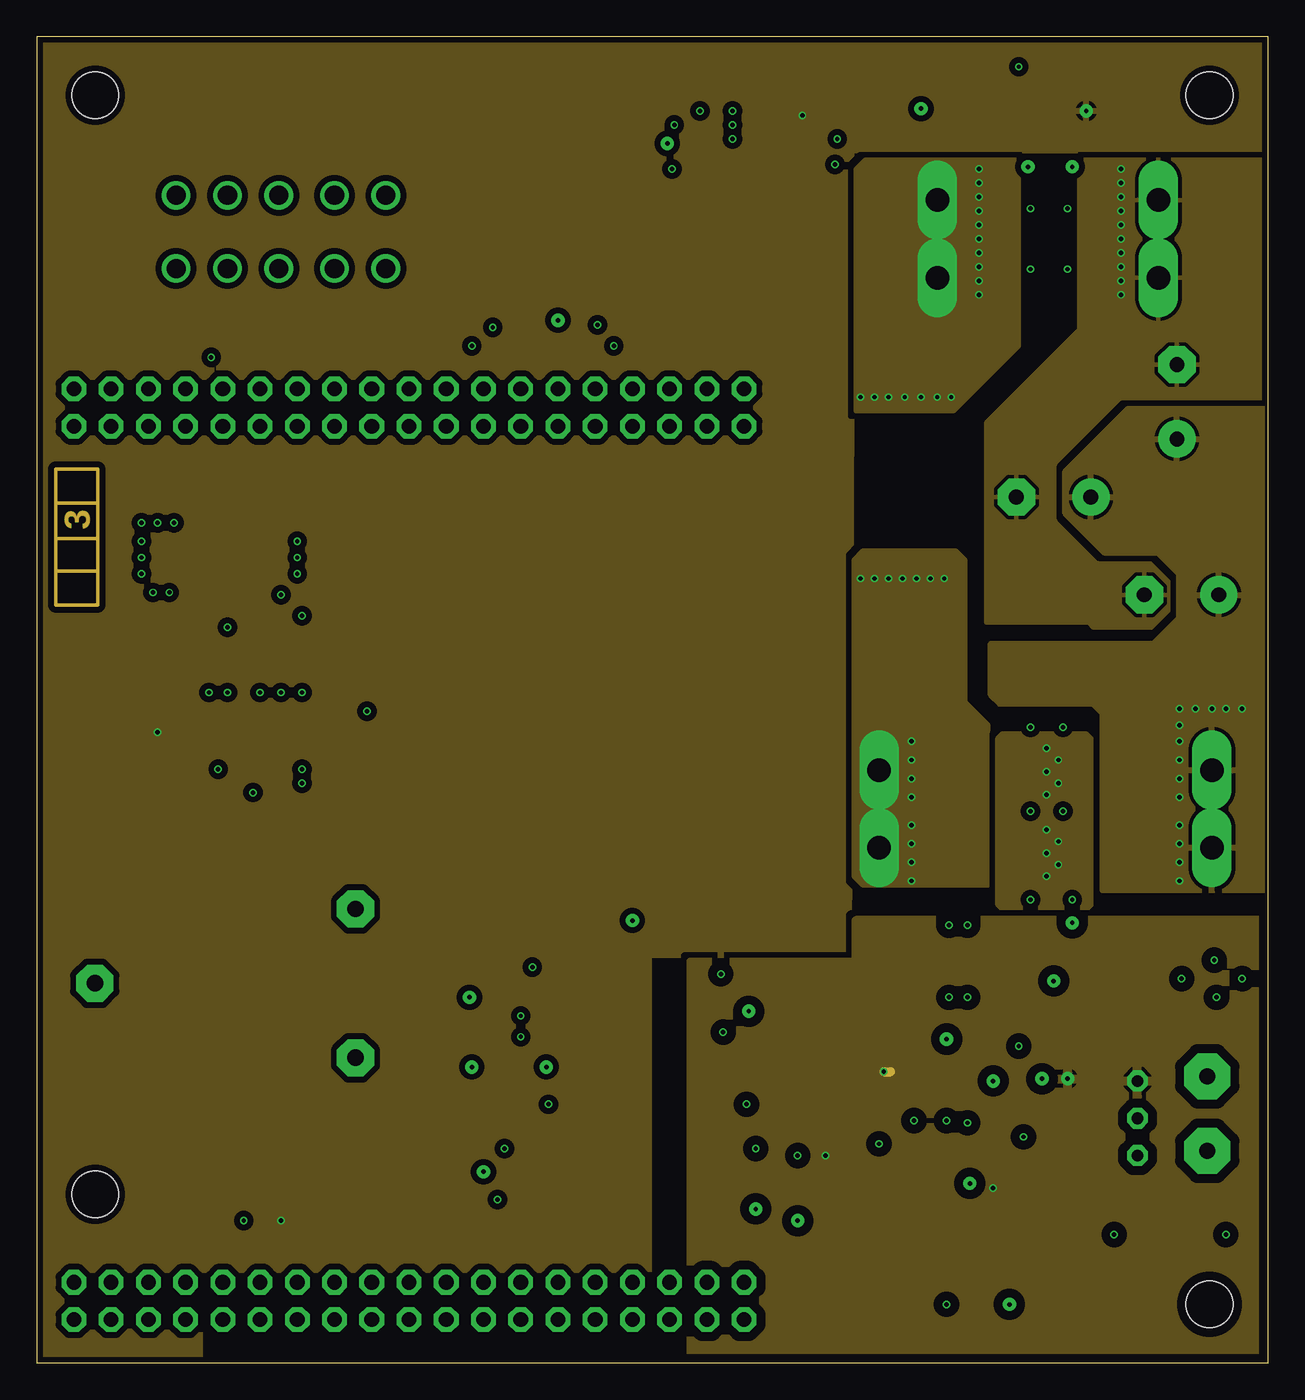
[diagram p5: board, inner layer Route15]
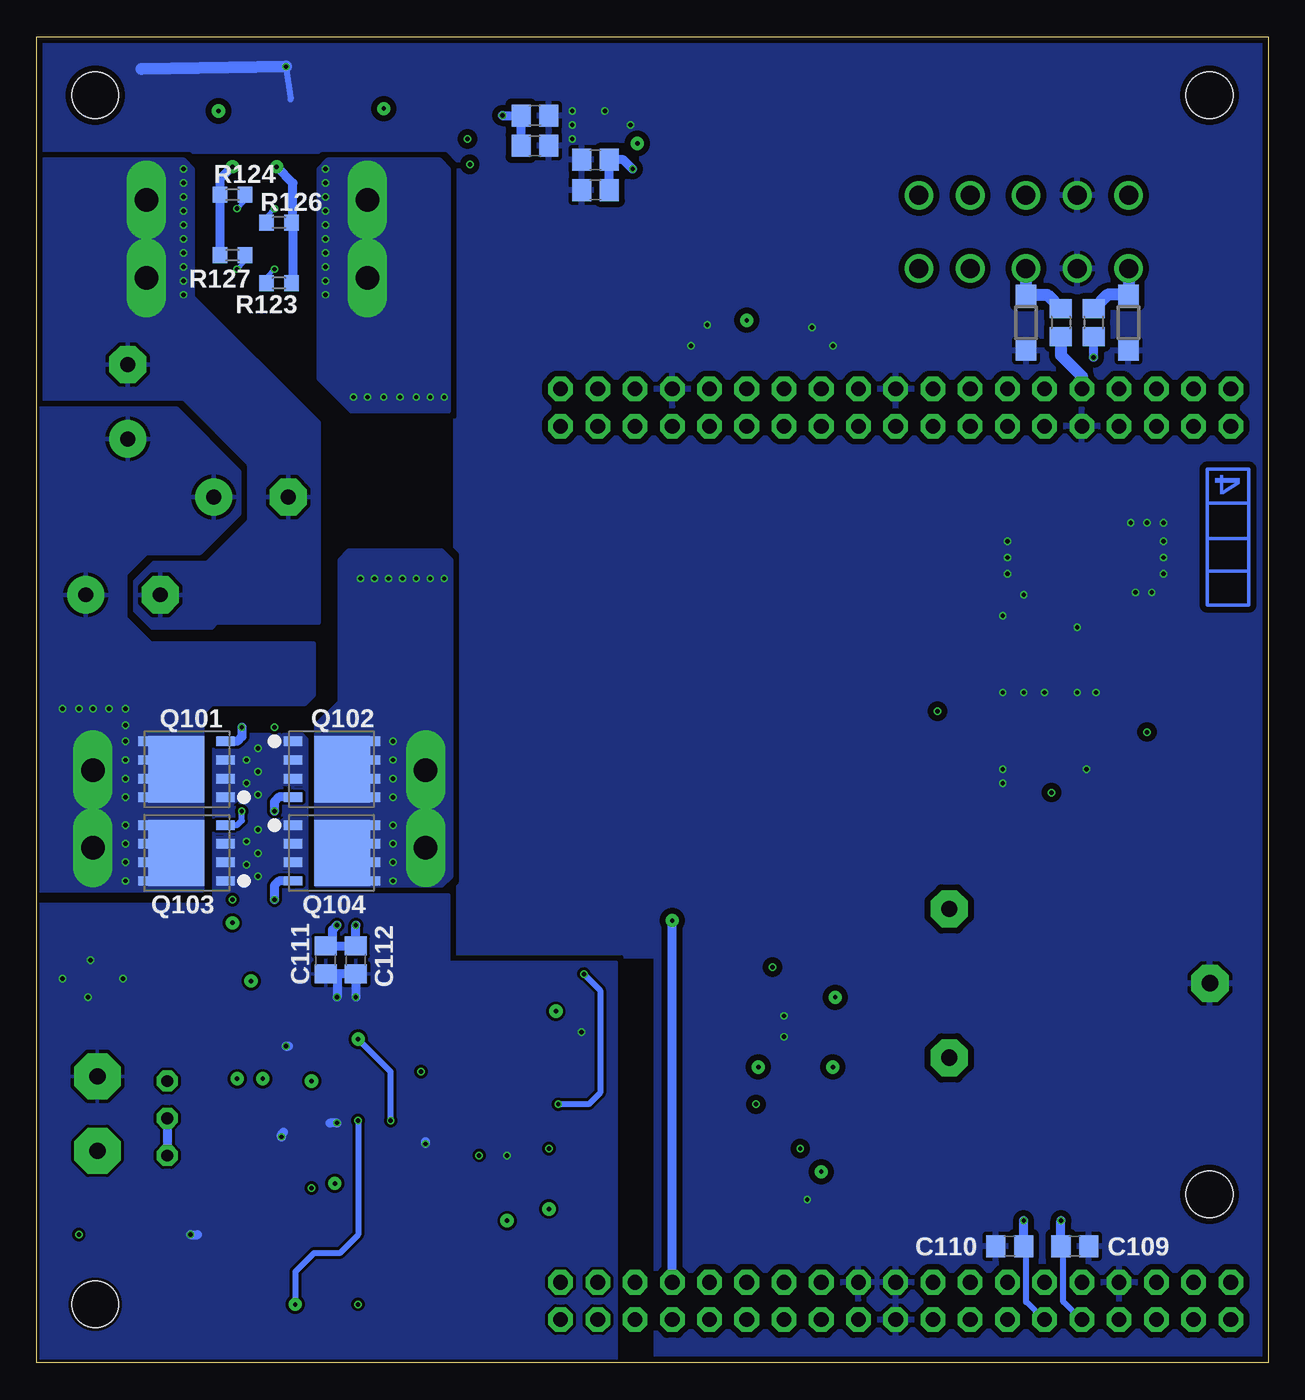
[diagram p6: board, bottom side, seen from below]

Size 84 x 90.5 mm. Coordinates in mm from the lower left corner, seen from the top.
Outline: 0,0 84,0 84,90.5 0,90.5 0,0
Copper layers (1*2*15*16): Top 0.035mm / dielectric 0.17mm / Route2 0.0175mm / dielectric 47mil / Route15 0.0175mm / dielectric 0.17mm / Bottom 0.035mm
Design rules "JLCPCB_4Layer": minimum track width 5mil, minimum drill 0.2mm, track to track 5mil, track to pad 0.2mm, pad to pad 5mil, via to via 5mil, smd to smd 0mil, copper to edge 0.2mm, drill to drill 0.5mm, minimum pad ring 4mil, minimum via ring 4mil, stop-mask expansion 3mil, vias tented up to drill 100mil, thermal gap 10mil
Holes 3.2 mm at 4,11.5 80,4 80,86.5 4,86.5

### Footprints (pad centres in the part's own frame; a part is rotated, then mirrored left to right if it is on the bottom)
C0603 = smd 1.1 x 1: 1 -0.85,0; 2 0.85,0
E5-10,5 = drill 1.016 pad 2.54: + -2.54,0 | drill 1.016 pad 2.54 octagon: - 2.54,0
PANASONIC_D = smd 3.2 x 1.6: + 2.5,0; - -2.5,0
C0805 = smd 1.3 x 1.5: 1 -0.95,0; 2 0.95,0
C1206 = smd 1.6 x 1.8: 1 -1.4,0; 2 1.4,0
SOD123 = smd 1.4 x 1.4: A 1.9,0; C -1.9,0
SOT23 = smd 1 x 1.4: 1 -0.95,-1.1; 2 0.95,-1.1; 3 0,1.1
SMC = smd 2.8 x 3.8: A 3.7,0; C -3.7,0
CR2032H = drill 1.118 pad 2.54 octagon: + 5.08,10.795; +@1 -5.08,10.795; - 0,-6.985
AB9V = drill 1.118 pad 3.15 octagon: + 0,2.54; - 0,-2.54
SO-08 = smd 0.6 x 2.2: 1 -1.905,-2.6; 2 -0.635,-2.6; 3 0.635,-2.6; 4 1.905,-2.6; 5 1.905,2.6; 6 0.635,2.6; 7 -0.635,2.6; 8 -1.905,2.6
SFH = smd 1.4 x 1.8: 1 1.27,5.08; 2 -1.27,5.08; 3 -1.27,-5.08; 4 1.27,-5.08
SO08 = smd 0.6 x 2.2: 1 -1.905,-2.6; 2 -0.635,-2.6; 3 0.635,-2.6; 4 1.905,-2.6; 5 1.905,2.6; 6 0.635,2.6; 7 -0.635,2.6; 8 -1.905,2.6
VOGT_3866A.68 = drill 1.6 pad 2.7 long: A1 -2.65,0; A2 2.65,0
SML0805 = smd 1.2 x 1.2: A 1.05,0; C -1.05,0
SOIC08 = smd 0.66 x 2.032: 1 -1.905,-3.073; 2 -0.635,-3.073; 3 0.635,-3.073; 4 1.905,-3.073; 5 1.905,3.073; 6 0.635,3.073; 7 -0.635,3.073; 8 -1.905,3.073
MICRO3 = smd 0.8 x 0.9: 1 -0.95,-1; 2 0.95,-1; 3 0,1
PDFN56 = smd 0.6 x 1.27: P$1 -1.905,-1.905; P$2 -0.635,-1.905; P$3 0.635,-1.905; P$4 1.905,-1.905 | smd 0.6 x 1.42: P$5 1.905,3.36; P$6 0.635,3.36; P$7 -0.635,3.36; P$8 -1.905,3.36 | smd 4.52 x 3.81: P$9 0,1.455
R0603 = smd 1 x 1.1: 1 -0.85,0; 2 0.85,0
R1206 = smd 1.6 x 1.803: 1 -1.422,0; 2 1.422,0
R0805 = smd 1.3 x 1.5: 1 -0.95,0; 2 0.95,0
R2512 = smd 1.8 x 3.2: 1 -2.8,0; 2 2.8,0
SS_ESP101 = drill 0.8 pad 1.422 octagon: A 2.54,0; B -2.54,0; C 0,0
C90H30 = drill 0.3 pad 0.9: P$1 0,0
C90 = smd 0.9 x 0.9: P$1 0,0
NUCLEO_BRD64_LOWER = drill 1 pad 1.676 octagon: L_3V3 5.79,33.02; L_5V 5.79,30.48; L_BOOT0 3.25,43.18; L_E5V 5.79,45.72; L_GND 5.79,43.18; L_GND3 3.25,27.94; L_GND4 5.79,25.4; L_GND5 5.79,27.94; L_IOREF 5.79,38.1; L_NC1 3.25,38.1; L_NC2 3.25,40.64; L_NC3 5.79,20.32; L_NC4 5.79,40.64; L_PA0 5.79,17.78; L_PA1 5.79,15.24; L_PA4 5.79,12.7; L_PA13 3.25,35.56; L_PA14 3.25,33.02; L_PA15 3.25,30.48; L_PB0 5.79,10.16; L_PB7 3.25,25.4; L_PC0 5.79,5.08; L_PC1 5.79,7.62; L_PC2 3.25,7.62; L_PC3 3.25,5.08; L_PC10 3.25,50.8; L_PC11 5.79,50.8; L_PC12 3.25,48.26; L_PC13 3.25,22.86; L_PC14 3.25,20.32; L_PC15 3.25,17.78; L_PD2 5.79,48.26; L_PF0 3.25,15.24; L_PF1 3.25,12.7; L_RESET 5.79,35.56; L_VBAT 3.25,10.16; L_VDD 3.25,45.72; L_VIN 5.79,22.86; R_AGND 66.75,12.7; R_AVDD 64.21,43.18; R_GND7 64.21,40.64; R_GND8 66.75,27.94; R_NC5 66.75,40.64; R_NC7 66.75,7.62; R_NC8 66.75,5.08; R_PA2 64.21,7.62; R_PA3 64.21,5.08; R_PA5 64.21,38.1; R_PA6 64.21,35.56; R_PA7 64.21,33.02; R_PA8 64.21,22.86; R_PA9 64.21,25.4; R_PA10 64.21,10.16; R_PA11 66.75,35.56; R_PA12 66.75,38.1; R_PB1 66.75,22.86; R_PB2 66.75,25.4; R_PB3 64.21,12.7; R_PB4 64.21,17.78; R_PB5 64.21,15.24; R_PB6 64.21,30.48; R_PB8 64.21,48.26; R_PB9 64.21,45.72; R_PB10 64.21,20.32; R_PB11 66.75,30.48; R_PB12 66.75,33.02; R_PB13 66.75,15.24; R_PB14 66.75,17.78; R_PB15 66.75,20.32; R_PC4 66.75,10.16; R_PC5 66.75,45.72; R_PC6 66.75,48.26; R_PC7 64.21,27.94; R_PC8 66.75,50.8; R_PC9 64.21,50.8; R_U5V 66.75,43.18
AST_452_3,5 = drill 1.3: 1_1 -1.75,2.5; 1_2 -1.75,-2.5; 2_1 1.75,2.5; 2_2 1.75,-2.5
AST_453_3,5 = drill 1.3: 1_1 -3.5,2.5; 1_2 -3.5,-2.5; 2_1 0,2.5; 2_2 0,-2.5; 3_1 3.5,2.5; 3_2 3.5,-2.5

### Placement (x,y rotation side)
C1  37.31,69.4 0 top
C2  78.11,52.41 180 top
C3  69.37,59.08 180 top
C4  77.79,65.59 90 top
C5  53.02,82.57 270 top
C101  77.63,26.22 180 top
C102  57.47,17.17 270 top
C103  16.19,57.49 90 top
C104  8.73,57.49 270 top
C105  15.72,50.98 0 top
C106  9.68,50.98 0 top
C107  15.72,40.51 0 top
C108  10.16,40.51 180 top
C109  13.18,7.96 0 bottom
C110  17.62,7.96 0 bottom
C111  64.29,27.49 270 bottom
C112  62.23,27.49 270 bottom
C113  45.88,82.1 180 bottom
C114  50.01,83.05 180 bottom
C115  45.88,80.03 180 bottom
C116  50.01,85.11 180 bottom
C119  70.33,49.87 90 top
C120  65.88,49.87 90 top
C121  68.1,49.87 90 top
D1  32.86,69.4 180 top
D101  16.51,70.98 270 bottom
D102  9.53,70.98 90 bottom
D103  64.77,22.57 90 top
D104  59.05,64.48 90 top
G1  10.95,25.9 270 top
G101  79.85,17.01 180 top
IC1  62.71,27.49 270 top
IC2  41.91,18.91 270 top
IC3  41.91,13.36 90 top
IC4  24.45,54.95 180 top
IC101  16.67,45.74 0 top
IC102  11.11,45.74 0 top
IC103  61.44,17.17 0 top
IC105  47.94,82.57 90 top
J102  80.17,37.81 270 top
J103  57.47,37.81 90 top
J106  61.44,76.7 270 top
J107  76.52,76.7 270 top
LED1  69.22,88.45 0 top
LED2  60.8,88.45 0 top
LED101  69.37,3.99 0 top
LED102  56.83,3.99 0 top
LED103  75.72,8.76 0 top
OK1  42.23,24.63 270 top
Q1  69.37,23.84 0 top
Q101  73.03,40.51 90 bottom
Q102  64.61,40.51 270 bottom
Q103  73.03,34.79 90 bottom
Q104  64.61,34.79 270 bottom
Q105  73.03,40.51 270 top
Q106  64.61,40.51 90 top
Q107  73.03,34.79 270 top
Q108  64.61,34.79 90 top
R1  73.34,88.45 180 top
R2  64.93,88.45 180 top
R3  33.97,14.63 180 top
R4  61.28,56.38 270 top
R5  59.05,56.38 270 top
R6  56.83,56.38 270 top
R7  32.38,20.18 180 top
R9  53.82,12.09 270 top
R101  14.13,70.98 270 bottom
R102  11.91,70.98 270 bottom
R103  59.85,21.93 0 top
R104  31.59,22.73 90 top
R105  65.25,13.68 90 top
R106  65.25,17.17 90 top
R107  67.31,17.17 270 top
R108  35.72,27.01 0 top
R110  22.54,46.85 90 top
R111  61.28,12.25 0 top
R112  73.03,3.99 0 top
R113  69.37,20.98 180 top
R114  60.33,3.99 180 top
R115  57.47,28.92 270 top
R116  79.22,8.76 180 top
R117  40.8,83.21 0 top
R118  69.69,28.12 180 top
R120  47.94,76.22 180 top
R121  81.6,81.94 270 top
R122  47.94,78.45 180 top
R123  67.47,73.68 180 bottom
R124  70.64,79.72 180 bottom
R125  69.06,78.76 180 top
R126  67.47,77.81 180 bottom
R127  70.64,75.59 180 bottom
R128  69.06,74.64 180 top
S101  75.09,16.69 90 top
T1  33.81,12.09 270 top
T3  50.8,12.09 90 top
T101  35.72,24 270 top
T102  25.72,46.54 0 top
TP1  68.58,19.39 270 top
TP2  49.05,10.5 0 top
TP3  29.53,24.95 0 top
TP4  29.69,20.18 0 top
TP5  40.64,30.19 0 top
TP6  30.48,13.04 0 top
TP101  70.33,19.39 180 top
TP102  62.07,22.09 180 top
TP103  34.77,20.18 0 top
TP104  63.66,12.25 180 top
TP105  65.25,19.23 180 top
TP106  51.91,9.71 0 top
TP107  66.36,3.99 0 top
TP108  48.58,24 90 top
TP109  69.37,26.06 270 top
TP110  35.56,71.14 180 top
TP111  43.02,83.21 270 top
TP112  70.64,30.03 0 top
TP113  45.24,78.61 270 top
TP114  50.96,78.61 270 top
TP115  67.63,81.62 0 top
TP116  70.64,81.62 0 top
TP117  60.33,85.59 0 top
TP118  71.6,85.43 0 top
U201  53.34,-0.29 90 top
U$7  [A4_LOC_CC_BY_NC_SA]  -69.85,-50.62 0 top  (outside the outline)
X1  22.07,77.18 180 top
X101  13.02,77.18 180 top

### Tracks (layer width: path | path; a pad name or v marks a point on that pad's centre or on a via)
9V_SWITCHED  (via drill 0.3)
  Top 0.406: v48.42,17.64 IC2.1
  Top 0.61: v62.23,29.87 61.75,29.39 IC1.1 58.74,29.39 58.26,29.87 57.57,29.87 R115.1 | IC1.8 63.98,29.39 v63.5,29.87 63.5,27.17 63.82,26.85 IC1.6 68.58,26.85 TP109.P$1 Q1.3 | R116.1 v81.12,8.76 | R114.1 v62.07,3.99 | OK1.8 v46.67,26.54
  Route2 0.61: v81.12,8.76 81.44,8.76 | v62.07,3.99 62.55,3.99
  Bottom 0.406: v46.67,26.54 45.56,25.42 45.56,18.44 46.35,17.64 v48.42,17.64
  Bottom 0.61: v62.23,29.87 C112.1 C111.1 63.82,28.44 63.82,29.55 v63.5,29.87
  pour Route2 (isolate 0.61): 44.61,27.33 44.61,-0.77 84.45,-0.77 84.45,30.19 55.88,30.19 55.88,27.33
+5V  (via drill 0.3)
  Top 0.61: C107.1 IC101.1 | IC2.4 v34.92,17.64 | R108.1 v33.81,27.01 | IC105.7 43.81,81.94 v43.34,81.46 | R3.2 v31.91,14.63 | R110.1 v22.54,44.47
  Top 1.016: v14.76,38.92 C107.1
  Route2 0.61: v31.91,14.63 31.43,14.63 31.27,14.79 | v22.54,44.47 22.07,44.47
  Bottom 0.406: U201.L_NC2 12.78,2.96 13.97,4.15 13.97,7.8 C109.1
  Bottom 0.61: v43.34,81.46 43.97,82.1 C113.1 C115.1 | C109.1 v14.13,9.71
  pour Route2 (isolate 0.406, rank 4): -0.48,-2.52 -0.48,91.5 85.57,91.5 85.57,82.73 55.56,82.73 55.56,65.59 55.4,27.8 41.75,27.8 41.75,-1.56 16.83,-1.56 16.83,4.31 11.11,4.31 11.11,-1.56 0.16,-1.56 0.16,-2.52
+9V  (via drill 0.3)
  Top 0.61: Q1.2 70.22,22.74 R113.1 70.33,20.88 TP101.P$1 75.09,19.39 | S101.A 75.09,19.39 | 75.09,19.39 75.09,26.18 C101.+ | R9.1 v53.82,14.15 | C102.1 57.47,19.55 v57.78,19.87 59.53,19.87 | IC103.8 59.53,19.87 | 59.53,19.87 59.53,20.5 59.05,20.98 59.05,21.88 R103.1 | R105.1 v65.25,11.93
  Route15 0.61: v57.78,19.87 58.26,19.87
  pour Route15 (isolate 0.61): 44.61,27.33 44.61,-0.77 84.45,-0.77 84.45,30.19 55.88,30.19 55.88,27.33
+15V
  Top 0.406: 13.97,65.11 13.97,62.89
  Top 0.61: C105.1 IC101.8 14.76,52.25 | U201.R_NC5 13.97,65.19 13.97,65.11 | 13.97,62.89 13.97,61.78 13.65,61.46 13.65,60.35 13.97,60.03
  Top 0.813: C103.+ 16.15,60.03 13.97,60.03 13.65,60.03 13.69,59.99
  Top 1.016: C103.+ 13.69,59.99 | 13.65,60.03 13.65,53.36 14.76,52.25
  Bottom 0.813: R101.2 14.13,68.76 12.7,67.33 U201.R_NC5
-5V  (via drill 0.3)
  Top 0.61: C108.2 IC102.1 8.35,43.14 v8.26,43.05 | IC105.4 51.59,84.48 v52.23,85.11
  Bottom 0.406: U201.L_NC1 15.31,2.96 16.51,4.15 16.51,7.8 C110.2
  Bottom 0.61: v52.23,85.11 C116.2 C114.2 | C110.2 v16.67,9.71
  pour Route15 (isolate 0.406, rank 4): -0.32,91.5 85.57,91.5 85.57,82.73 55.56,82.73 55.56,65.59 55.4,27.8 41.75,27.8 41.75,-1.56 41.43,-1.56 16.83,-1.56 16.83,-0.77 16.83,4.31 11.11,4.31 11.11,-1.56 0.16,-1.56 0.16,-2.52 -0.48,-2.52
-15V  (via drill 0.3)
  Top 0.305: C106.2 10.79,51.14 11.11,51.14
  Top 0.406: 11.43,62.89 11.43,67.65
  Top 0.61: IC102.3 IC102.2 IC102.7 | IC102.6 IC102.7 | IC102.7 11.01,48.34 11.11,48.44 | 11.11,60.03 11.11,62.25 11.43,62.57 11.43,62.89 | 11.43,67.65 11.43,68.13 v11.91,68.6
  Top 0.813: 8.77,60.03 C104.-
  Top 1.016: 8.77,60.03 11.11,60.03 11.11,51.14 11.11,48.44
  Bottom 0.61: v11.91,68.6 R102.2
AGND  (via drill 0.3)
  Top 0.61: IC102.5 v13.02,45.74 | IC101.7 16.03,46.54 v15.24,45.74 16.03,44.95 IC101.2 | IC101.3 17.3,44.95 v18.1,45.74 17.3,46.54 IC101.6 | C108.1 v12.38,40.51
  Bottom 0.406: v66.99,88.45 66.67,86.22
  Bottom 0.813: v66.99,88.45 76.83,88.29
  other vias: 13.02,50.19 11.75,45.74 7.14,56.06 7.14,54.95 7.14,53.84 7.94,52.57 9.05,52.57 17.78,53.84 17.78,56.06 17.78,54.95 18.1,39.55 18.1,40.51 16.67,45.74 7.14,57.33 8.26,57.33 9.37,57.33 33.02,23.68 33.02,22.25 31.43,11.14 18.1,50.98 16.67,52.41 38.26,70.83 39.37,69.4 29.69,69.4 31.11,70.67 43.5,84.48 45.24,85.43 47.47,85.43 47.47,83.53 47.47,84.48
  pour Bottom (isolate 0.406, rank 4): -0.48,-2.52 -0.48,91.5 85.57,91.5 85.57,82.73 57.63,82.73 55.4,80.51 55.4,27.8 41.75,27.8 41.75,-1.56 0.16,-1.56 0.16,-2.52
  pour Top (isolate 0.406, rank 4): -0.48,-2.52 -0.48,91.5 85.57,91.5 85.57,82.73 57.63,82.73 55.4,80.51 55.4,27.8 41.75,27.8 41.75,-1.56 0.16,-1.56 0.16,-2.52
CURR_AMP_GAIN_N
  Top 0.406: 50.48,78.45 R122.1 R120.1 | 50.48,78.45 50.8,78.45 TP114.P$1 | IC105.1 50.96,80.67 50.96,78.92 50.48,78.45
CURR_AMP_GAIN_P
  Top 0.406: IC105.8 45.34,78.7 TP113.P$1 46.83,78.61 R122.2 R120.2
CURR_AMP_OUT
  Top 0.406: R117.2 TP111.P$1 IC105.6
CURR_MEAS_AI
  Top 0.406: U201.R_PB14 35.56,69.4 | 35.56,69.4 D1.C | TP110.P$1 35.56,69.4 | C1.1 35.56,69.4
  Top 0.61: R117.1 36.51,83.21 35.56,82.26 TP110.P$1
GND_ISO  (via drill 0.3)
  Top 0.61: v62.23,24.95 62.23,24.79 | v63.5,24.95 63.5,24.79 | T3.2 v51.91,14.15 | OK1.5 46.67,22.73 v46.83,22.57 | LED103.C v73.5,8.76 | C102.2 v57.47,14.95 | D103.1 v66.99,21.62 v66.99,21.61 | IC103.4 63.34,16.22 v63.5,16.38 63.6,16.48 | R107.2 v67.31,15.42 | IC1.4 IC1.3 61.91,26.85 C112.2
  Bottom 0.61: v62.23,24.95 C112.2 C111.2 63.5,26.54 v63.5,24.95 | v73.5,8.76 73.03,8.76 | v57.47,14.95 57.47,15.11 | v66.99,21.61 66.83,21.61 | v63.5,16.38 63.98,16.38 | v67.31,15.42 67.31,15.58 67.15,15.74
  other vias: 69.69,41.14 68.9,40.35 69.69,39.55 68.9,38.76 68.9,41.93 69.69,35.58 68.9,34.79 69.69,34 68.9,33.2 68.9,36.38 82.23,26.22 80.33,27.49 80.49,24.95 78.11,26.22
  pour Bottom: 65.56,42.57 65.56,31.93 55.88,31.93 55.88,27.33 44.45,27.33 44.45,-0.29 84.3,-0.29 84.3,31.3 71.91,31.3 71.91,42.57 71.6,42.89 65.88,42.89
  pour Top (isolate 0.406): 65.56,42.57 65.56,31.93 55.88,31.93 55.88,27.33 44.45,27.33 44.45,-0.29 84.3,-0.29 84.3,31.3 71.91,31.3 71.91,42.57 71.6,42.89 65.88,42.89
  pour Route15 (isolate 0.406, rank 2): 65.56,42.57 65.56,31.3 66.2,30.66 71.28,30.66 71.91,31.3 71.91,42.57 71.6,42.89 65.88,42.89
  pour Route2 (isolate 0.406, rank 2): 65.56,42.57 65.56,31.3 66.2,30.66 71.28,30.66 71.91,31.3 71.91,42.57 71.6,42.89 65.88,42.89
  pour Top (isolate 0.406, no thermals): 65.56,42.57 65.56,31.3 66.2,30.66 71.28,30.66 71.91,31.3 71.91,42.57 71.6,42.89 65.88,42.89
  pour Bottom (isolate 0.406, no thermals): 65.56,42.57 65.56,31.3 66.2,30.66 71.28,30.66 71.91,31.3 71.91,42.57 71.6,42.89 65.88,42.89
I_SEN_IN  (via drill 0.3)
  Top 0.406: v67.79,74.64 R128.2 66.2,74.58 | v67.79,78.76 R125.2
  Bottom 0.305: R126.2 68.32,78.23 v67.79,78.76 | R123.2 68.32,74.1 v67.79,74.64
  other vias: 64.29,81.46 64.29,80.51 64.29,79.56 64.29,78.61 64.29,77.65 64.29,76.7 58.1,65.91 59.21,65.91 60.33,65.91 61.44,65.91 57.15,65.91 56.2,65.91 62.39,65.91 64.29,75.75 64.29,74.8 64.29,73.84 64.29,72.89
  pour Bottom (isolate 0.406, rank 3, no thermals): 62.55,64.95 55.88,64.95 55.88,81.46 56.52,82.1 64.14,82.1 64.77,81.46 64.77,67.17
  pour Top (isolate 0.406, rank 3, no thermals): 62.55,64.95 55.88,64.95 55.88,81.46 56.52,82.1 66.99,82.1 66.99,69.4
  pour Route2 (isolate 0.406, rank 3, no thermals): 62.55,64.95 55.88,64.95 55.88,81.46 56.52,82.1 66.99,82.1 66.99,69.4
  pour Route15 (isolate 0.406, rank 3, no thermals): 62.55,64.95 55.88,64.95 55.88,81.46 56.52,82.1 66.99,82.1 66.99,69.4
I_SEN_OUT  (via drill 0.3)
  Top 0.406: v70.33,78.76 R125.1 | v70.33,74.64 R128.1
  Bottom 0.305: R124.1 69.79,79.3 v70.33,78.76 | R127.1 69.79,75.17 v70.33,74.64
  other vias: 73.98,81.46 73.98,80.51 73.98,79.56 73.98,78.61 73.98,77.65 73.98,73.84 73.98,74.8 73.98,76.7 73.98,75.75 73.98,72.89
  pour Bottom (isolate 0.406, rank 2): 84.84,65.75 74.14,65.75 69.53,61.14 69.53,57.65 72.55,54.63 76.2,54.63 77.31,53.52 77.31,51.3 76.2,50.19 72.07,50.19 71.75,50.51 64.77,50.51 64.77,64.16 73.34,72.73 73.34,81.46 73.98,82.1 84.84,82.1
  pour Top (isolate 0.406, rank 2): 84.84,65.75 74.14,65.75 69.53,61.14 69.53,57.65 72.55,54.63 76.2,54.63 77.31,53.52 77.31,51.3 76.2,50.19 72.07,50.19 71.75,50.51 64.77,50.51 64.77,64.16 71.12,70.51 71.12,82.1 84.84,82.1
  pour Bottom (isolate 0.406, no thermals): 79.22,70.83 79.22,82.1 74.14,82.1 74.14,70.83
  pour Top (isolate 0.406, no thermals): 79.22,70.83 79.22,82.1 71.12,82.1 71.12,70.83
  pour Route2 (isolate 0.406, rank 2): 84.84,65.75 74.14,65.75 69.53,61.14 69.53,57.65 72.55,54.63 76.2,54.63 77.31,53.52 77.31,51.3 76.2,50.19 72.07,50.19 71.75,50.51 64.77,50.51 64.77,64.16 71.12,70.51 71.12,82.1 84.84,82.1
  pour Route15 (isolate 0.406, rank 2): 84.84,65.75 74.14,65.75 69.53,61.14 69.53,57.65 72.55,54.63 76.2,54.63 77.31,53.52 77.31,51.3 76.2,50.19 72.07,50.19 71.75,50.51 64.77,50.51 64.77,64.16 71.12,70.51 71.12,82.1 84.84,82.1
I_SENSE_N  (via drill 0.3)
  Top 0.406: IC105.2 52.81,81.94 C5.2 54.4,81.72 v54.45,81.78
  Route2 0.406: 70.57,81.62 TP116.P$1 69.69,80.67 66.9,80.67 64.76,82.81 55.24,82.81 54.45,82.01 v54.45,81.78
  Bottom 0.406: 71.44,75.59 R127.2
  Bottom 0.61: R127.2 R124.2 71.49,80.77 TP116.P$1
I_SENSE_P  (via drill 0.3)
  Top 0.406: IC105.3 52.81,83.21 C5.1 53.12,83.53 v54.61,83.53
  Route2 0.406: TP115.P$1 67.54,81.62 67.54,81.71 67,81.71 65.1,83.61 54.7,83.61 v54.61,83.53
  Bottom 0.406: R126.1 66.52,77.81
  Bottom 0.61: R123.1 66.52,73.68 66.52,77.81 66.52,80.51 TP115.P$1
IN+
  Top 0.61: X101.1_2 16.52,87.19 17.3,87.97 57.47,87.97 58.42,87.02 73.82,87.02 74.14,87.34 74.14,88.39 R1.1
  Top 0.813: X101.1_1 X101.1_2
  Bottom 0.813: R101.1 15.08,72.89 D101.C 16.51,74.67 X101.1_1
IN-
  Top 0.61: X101.3_2 9.52,87.96 10.64,89.08 58.1,89.08 58.74,88.45 LED2.C
  Top 0.813: X101.3_2 X101.3_1
  Bottom 0.813: X101.3_1 9.52,72.89 D102.A 10.96,72.89 R102.1
N$1  (via drill 0.3)
  other vias: 77.95,32.88 77.95,34.16 77.95,35.42 77.95,36.7 77.95,38.6 77.95,39.87 77.95,41.14 77.95,42.41 77.95,43.52 77.95,44.63 79.06,44.63 80.17,44.63 81.12,44.63 82.23,44.63
  pour Bottom: 72.71,32.25 72.71,44.31 72.07,44.95 65.72,44.95 65.09,45.59 65.09,49.08 76.2,49.08 77.95,50.82 77.95,53.84 76.52,55.27 72.87,55.27 70.17,57.97 70.17,60.83 74.45,65.11 85.84,65.11 85.84,32.25
  pour Top: 72.71,32.25 72.71,44.31 72.07,44.95 65.72,44.95 65.09,45.59 65.09,49.08 76.2,49.08 77.95,50.82 77.95,53.84 76.52,55.27 72.87,55.27 70.17,57.97 70.17,60.83 74.45,65.11 85.84,65.11 85.84,32.25
  pour Top (no thermals): 72.71,32.25 72.71,44.31 85.21,44.31 85.84,43.68 85.84,32.25
  pour Route2: 72.71,32.25 72.71,44.31 72.07,44.95 65.72,44.95 65.09,45.59 65.09,49.08 76.2,49.08 77.95,50.82 77.95,53.84 76.52,55.27 72.87,55.27 70.17,57.97 70.17,60.83 74.45,65.11 85.84,65.11 85.84,32.25
  pour Route15: 72.71,32.25 72.71,44.31 72.07,44.95 65.72,44.95 65.09,45.59 65.09,49.08 76.2,49.08 77.95,50.82 77.95,53.84 76.52,55.27 72.87,55.27 70.17,57.97 70.17,60.83 74.45,65.11 85.84,65.11 85.84,32.25
  pour Bottom (no thermals): 72.71,32.25 72.71,44.31 85.21,44.31 85.84,43.68 85.84,32.25
N$2
  Top 0.61: IC1.7 R118.2
N$3  (via drill 0.3)
  Top 0.61: v70.01,37.65 70.01,38.28 70.33,38.6 Q105.P$4 | Q107.P$4 70.96,32.88 70.64,32.57 v70.64,31.61 TP112.P$1 70.64,28.6 70.64,28.12 R118.1 | Q108.P$4 67.47,36.7 67.79,37.01 v67.79,37.65 | Q106.P$4 67.47,42.41 67.79,42.73 v67.79,43.36
  Route2 0.61: v67.79,37.65 v67.79,43.36 v70.01,43.36 | v67.79,37.65 v67.79,31.61 v70.64,31.61 | v67.79,37.65 v70.01,37.65
  Bottom 0.406: Q103.P$4 70.33,36.7 70.01,37.01 v70.01,37.65
  Bottom 0.61: Q102.P$4 67.47,38.6 67.79,38.28 v67.79,37.65 | Q104.P$4 67.47,32.88 67.79,32.57 v67.79,31.61 | v70.01,43.36 70.01,42.73 70.33,42.41 Q101.P$4
N$4
  Top 0.61: R110.2 22.54,48.28 23.18,48.92 IC4.1
N$5
  Top 0.406: LED102.C 53.02,3.99 48.9,8.12 44.93,8.12 43.5,9.55 43.5,23.52 43.97,24 OK1.6 TP108.P$1
  Top 0.61: IC1.2 57.52,28.12 R115.2 57.47,25.42 56.04,24 TP108.P$1
N$6
  Top 0.254: 4.16,54.04 1.3,54.04 | 4.16,54.04 4.16,51.72 1.3,51.72 1.3,54.04 | 4.16,56.27 4.16,54.04 | 4.16,58.66 4.16,56.27 | 4.16,58.66 4.16,60.98 1.3,60.98 1.3,58.66 | 4.16,58.66 1.3,58.66 | 1.3,56.27 1.3,58.66 | 4.16,56.27 1.3,56.27 | 1.3,54.04 1.3,56.27
N$7  (via drill 0.3)
  Top 0.406: IC103.7 60.8,17.8 v62.07,16.53 | LED101.C TP107.P$1
  Bottom 0.406: v62.07,16.53 62.07,8.76 63.34,7.49 65.09,7.49 66.36,6.21 TP107.P$1
N$8
  Top 0.61: T102.3 IC4.2
N$9
  Bottom 0.254: 4.16,54.04 1.3,54.04 | 4.16,54.04 4.16,51.72 1.3,51.72 1.3,54.04 | 4.16,56.27 4.16,54.04 | 4.16,58.66 4.16,56.27 | 4.16,58.66 4.16,60.98 1.3,60.98 1.3,58.66 | 4.16,58.66 1.3,58.66 | 1.3,56.27 1.3,58.66 | 4.16,56.27 1.3,56.27 | 1.3,54.04 1.3,56.27
N$10
  Route2 0.254: 4.16,54.04 1.3,54.04 | 4.16,54.04 4.16,51.72 1.3,51.72 1.3,54.04 | 4.16,56.27 4.16,54.04 | 4.16,58.66 4.16,56.27 | 4.16,58.66 4.16,60.98 1.3,60.98 1.3,58.66 | 4.16,58.66 1.3,58.66 | 1.3,56.27 1.3,58.66 | 4.16,56.27 1.3,56.27 | 1.3,54.04 1.3,56.27
N$11
  Route15 0.254: 4.16,54.04 1.3,54.04 | 4.16,54.04 4.16,51.72 1.3,51.72 1.3,54.04 | 4.16,56.27 4.16,54.04 | 4.16,58.66 4.16,56.27 | 4.16,58.66 4.16,60.98 1.3,60.98 1.3,58.66 | 4.16,58.66 1.3,58.66 | 1.3,56.27 1.3,58.66 | 4.16,56.27 1.3,56.27 | 1.3,54.04 1.3,56.27
N$12
  Top 0.305: 29.21,6.37 29.21,4.47 29.43,4.25 41.89,4.25 U201.L_VBAT
  Top 0.406: G1.+ 25.72,20.82 27.3,19.23 27.3,8.28 29.21,6.37
N$13
  Top 0.61: S101.B 79.53,14.15 G101.+
  Bottom 0.61: S101.C S101.B
N$14
  Top 0.61: LED103.A R116.2
N$15  (via drill 0.3)
  Top 0.406: IC3.4 v49.05,14.63
  Top 0.61: Q1.1 68.42,21.08 R113.2 68.52,19.45 TP1.P$1
  Route2 0.406: v49.05,14.63 50.48,13.2 67.79,13.2 68.74,14.15 68.74,19.23 TP1.P$1
N$16
  Top 0.61: LED102.A R114.2
N$18
  Top 0.61: T101.3 OK1.3
N$21
  Top 0.61: T1.3 IC3.2
N$22
  Top 0.61: R3.1 IC3.1
N$23
  Top 1.422: R6.1 56.83,60.78 D104.C | R4.1 61.28,60.78 D104.C | R5.1 D104.C
N$24
  Top 0.61: R7.1 TP103.P$1 IC2.3
N$26
  Top 0.61: IC3.3 T3.3 49.69,12.08 49.69,11.14 TP2.P$1
N$32  (via drill 0.3)
  Top 0.406: IC103.5 63.34,22.24 D103.3 | IC103.2 60.8,16.22 60.48,16.53 v59.85,16.53
  Top 0.61: R103.2 61.75,21.93 TP102.P$1 62.07,22.25 62.39,22.57 D103.3
  Bottom 0.406: v59.85,16.53 59.85,19.87 TP102.P$1
N$33
  Top 0.406: IC103.6 62.07,18.76 62.87,17.96 65.19,17.96 R106.2 TP105.P$1
  Top 0.61: R107.1 R106.2
N$41
  Top 0.305: R111.2 TP104.P$1 64.14,12.72 64.14,14.31 64.35,14.53 R105.2 R106.1
  Top 0.61: IC103.3 62.07,12.3 R111.2
N$42
  Top 0.61: IC2.2 45.56,20.18 44.93,19.55 44.93,10.66 46.2,9.39 49.69,9.39 50.48,8.6 70.8,8.6 72.39,7.01 73.82,5.58 73.82,4.05 R112.2
N$43
  Top 0.61: IC103.1 59.53,12.41 59.69,12.25 | 59.69,12.25 R111.1 | TP106.P$1 T3.1 52.06,11.29 53.76,11.29 R9.2 58.84,11.24 59.69,12.09 59.69,12.25
N$46
  Top 0.61: OK1.2 37.31,25.27 36.67,25.9 36.67,26.91 R108.2
N$47  (via drill 0.3)
  other vias: 59.69,32.88 59.69,34.16 59.69,35.42 59.69,36.7 59.69,38.6 59.69,39.87 59.69,41.14 59.69,42.41 58.1,53.52 59.05,53.52 60.01,53.52 57.15,53.52 60.96,53.52 61.91,53.52 56.2,53.52
  pour Bottom (isolate 0.406, rank 2, no thermals): 64.93,32.57 56.36,32.57 55.72,33.2 55.72,54.79 56.36,55.43 62.71,55.43 63.34,54.79 63.34,45.11 64.93,43.52
  pour Top (isolate 0.406, rank 2, no thermals): 64.93,32.57 56.36,32.57 55.72,33.2 55.72,54.79 56.36,55.43 62.71,55.43 63.34,54.79 63.34,45.11 64.93,43.52
  pour Route2 (isolate 0.406, rank 3, no thermals): 64.93,32.57 56.36,32.57 55.72,33.2 55.72,54.79 56.36,55.43 62.71,55.43 63.34,54.79 63.34,45.11 64.93,43.52
  pour Route15 (isolate 0.406, rank 3, no thermals): 64.93,32.57 56.36,32.57 55.72,33.2 55.72,54.79 56.36,55.43 62.71,55.43 63.34,54.79 63.34,45.11 64.93,43.52
N$53
  Top 0.61: LED101.A R112.1
N$54
  Top 0.813: R1.2 LED1.A
N$58
  Top 0.406: R2.2 LED2.A
OK_PSU_C
  Top 0.305: 21.59,62.25 21.59,67.81
  Top 0.61: X1.2_2 X1.2_1 20.32,69.72 21.59,68.44 21.59,67.81 | IC4.4 23.18,60.67 21.59,62.25
OK_PSU_E
  Top 0.305: 24.13,62.41 24.13,67.81
  Top 0.61: X1.1_2 X1.1_1 23.81,69.4 24.13,69.08 24.13,67.81 | IC4.3 25.72,60.83 24.13,62.41
PSU_ENABLE_DO
  Top 0.61: T102.1 24.77,34.31 27.3,31.77 40.01,31.77 40.64,31.14 TP5.P$1
  Bottom 0.61: U201.L_PA4 TP5.P$1
PWSTG_ENABLE_DO
  Top 0.406: U201.L_PA0 35.56,7.01 34.92,7.64 29.05,7.64 28.1,8.6 28.1,24.15 28.89,24.95 TP3.P$1 T101.1
PWSTG_PWR_EN_DO
  Top 0.406: U201.L_PB0 43.18,5.58 41.75,7.01 38.1,7.01 35.72,9.39 30.32,9.39 29.84,9.87 29.84,12.41 TP6.P$1 T1.1
PWSTG_UVLO_DI
  Top 0.406: U201.L_PA1 38.1,5.9 35.4,8.6 29.53,8.6 29.05,9.07 29.05,19.55 TP4.P$1 R7.2
  Top 0.61: R7.2 31.54,21.82 R104.1

### Text on the board
Top: 1
Route2: 2
Route15: 3
Bottom: 4
tPlace: PSU / ENABLE | +5V | -5V | -12V | GND | +12V | C | E | ON | OFF | POWER | JLCJLCJLCJLC | ENABLED | LO BATT
tNames: A | T | µTTA V1 | J | T | P